# Altium project 8MPLUSLPD4-CPU.PrjPcb (part 1 of 3)
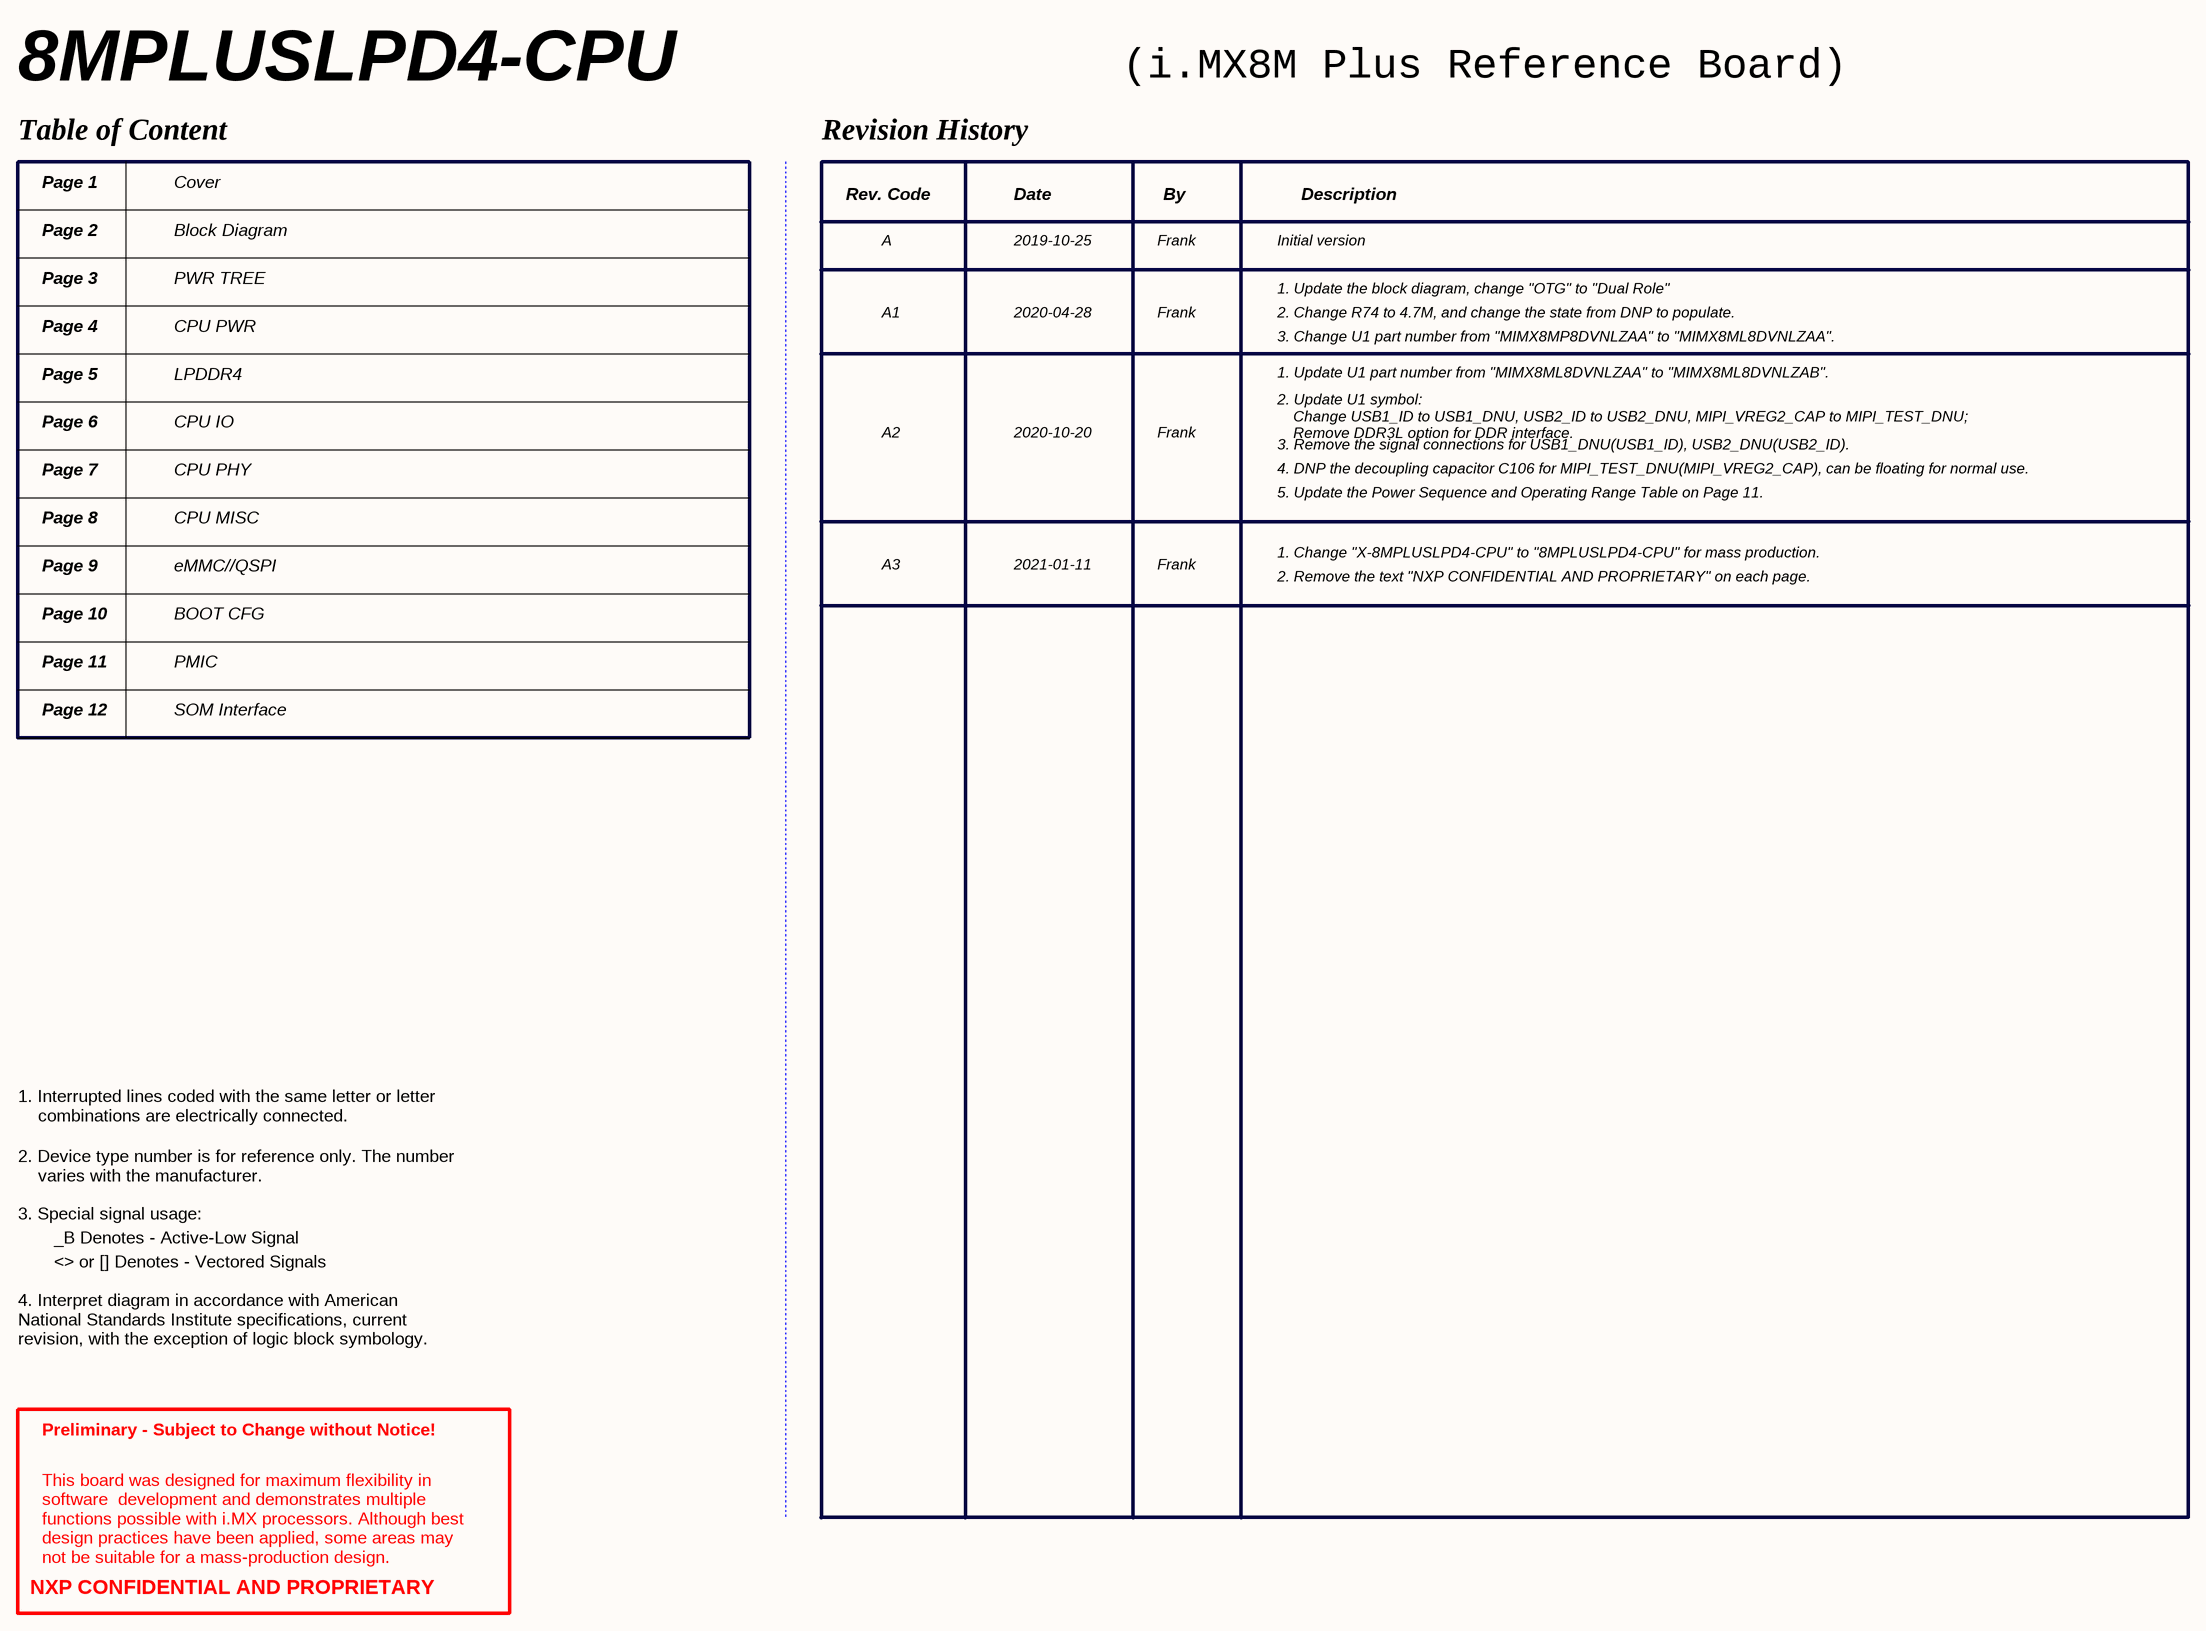
[diagram p0: Page01 COVER.SchDoc]
12 sheets, 271 parts. Net scope: global (net labels, ports and power ports of the same name join across sheets).
Board file: LAY-46368_A1_Altium.PcbDoc
Sheets:
  Page01 COVER.SchDoc
  Page02 BLOCK DIAGRAM.SchDoc
  Page03 PWR TREE.SchDoc
  Page04 CPU PWR.SchDoc
  Page05 LPDDR4.SchDoc
  Page06 CPU IO.SchDoc
  Page07 CPU PHY.SchDoc
  Page08 CPU MISC.SchDoc
  Page09 eMMC_QSPI.SchDoc
  Page10 BOOT_CFG.SchDoc
  Page11 PMIC.SchDoc
  Page12 SOM Interface.SchDoc

## Sheet Page01 COVER.SchDoc
size 513 x 386 mm

### Notes on the sheet
- 8MPLUSLPD4-CPU
- (i.MX8M Plus Reference Board)
- Table of Content
- Revision History
- Page 1
- Page 2
- Cover
- Block Diagram
- Rev. Code
- A
- Date
- 2019-10-25
- Frank
- By
- Initial version
- Description
- Page 3
- PWR TREE
- 1. Update the block diagram, change "OTG" to "Dual Role"
- Page 4
- CPU PWR
- A1
- 2020-04-28
- 2. Change R74 to 4.7M, and change the state from DNP to populate.
- 3. Change U1 part number from "MIMX8MP8DVNLZAA" to "MIMX8ML8DVNLZAA".
- Page 5
- LPDDR4
- 1. Update U1 part number from "MIMX8ML8DVNLZAA" to "MIMX8ML8DVNLZAB".
- 2. Update U1 symbol:
  Change USB1_ID to USB1_DNU, USB2_ID to USB2_DNU, MIPI_VREG2_CAP to MIPI_TEST_DNU;
  Remove DDR3L option for DDR interface.
- Page 6
- Page 7
- CPU IO
- CPU PHY
- A2
- 2020-10-20
- 3. Remove the signal connections for USB1_DNU(USB1_ID), USB2_DNU(USB2_ID).
- 4. DNP the decoupling capacitor C106 for MIPI_TEST_DNU(MIPI_VREG2_CAP), can be floating for normal use.
- Page 8
- CPU MISC
- 5. Update the Power Sequence and Operating Range Table on Page 11.
- Page 9
- eMMC//QSPI
- A3
- 2021-01-11
- 1. Change "X-8MPLUSLPD4-CPU" to "8MPLUSLPD4-CPU" for mass production.
- 2. Remove the text "NXP CONFIDENTIAL AND PROPRIETARY" on each page.
- Page 10
- BOOT CFG
- Page 11
- Page 12
- PMIC
- SOM Interface
- 1. Interrupted lines coded with the same letter or letter
  combinations are electrically connected.
- 2. Device type number is for reference only. The number
  varies with the manufacturer.
- 3. Special signal usage:
- _B Denotes - Active-Low Signal
- 4. Interpret diagram in accordance with American
  National Standards Institute specifications, current
  revision, with the exception of logic block symbology.
- <> or [] Denotes - Vectored Signals
- Preliminary - Subject to Change without Notice!
- This board was designed for maximum flexibility in
  software  development and demonstrates multiple
  functions possible with i.MX processors. Although best
  design practices have been applied, some areas may
  not be suitable for a mass-production design.
- NXP CONFIDENTIAL AND PROPRIETARY

## Sheet Page02 BLOCK DIAGRAM.SchDoc
size 513 x 386 mm
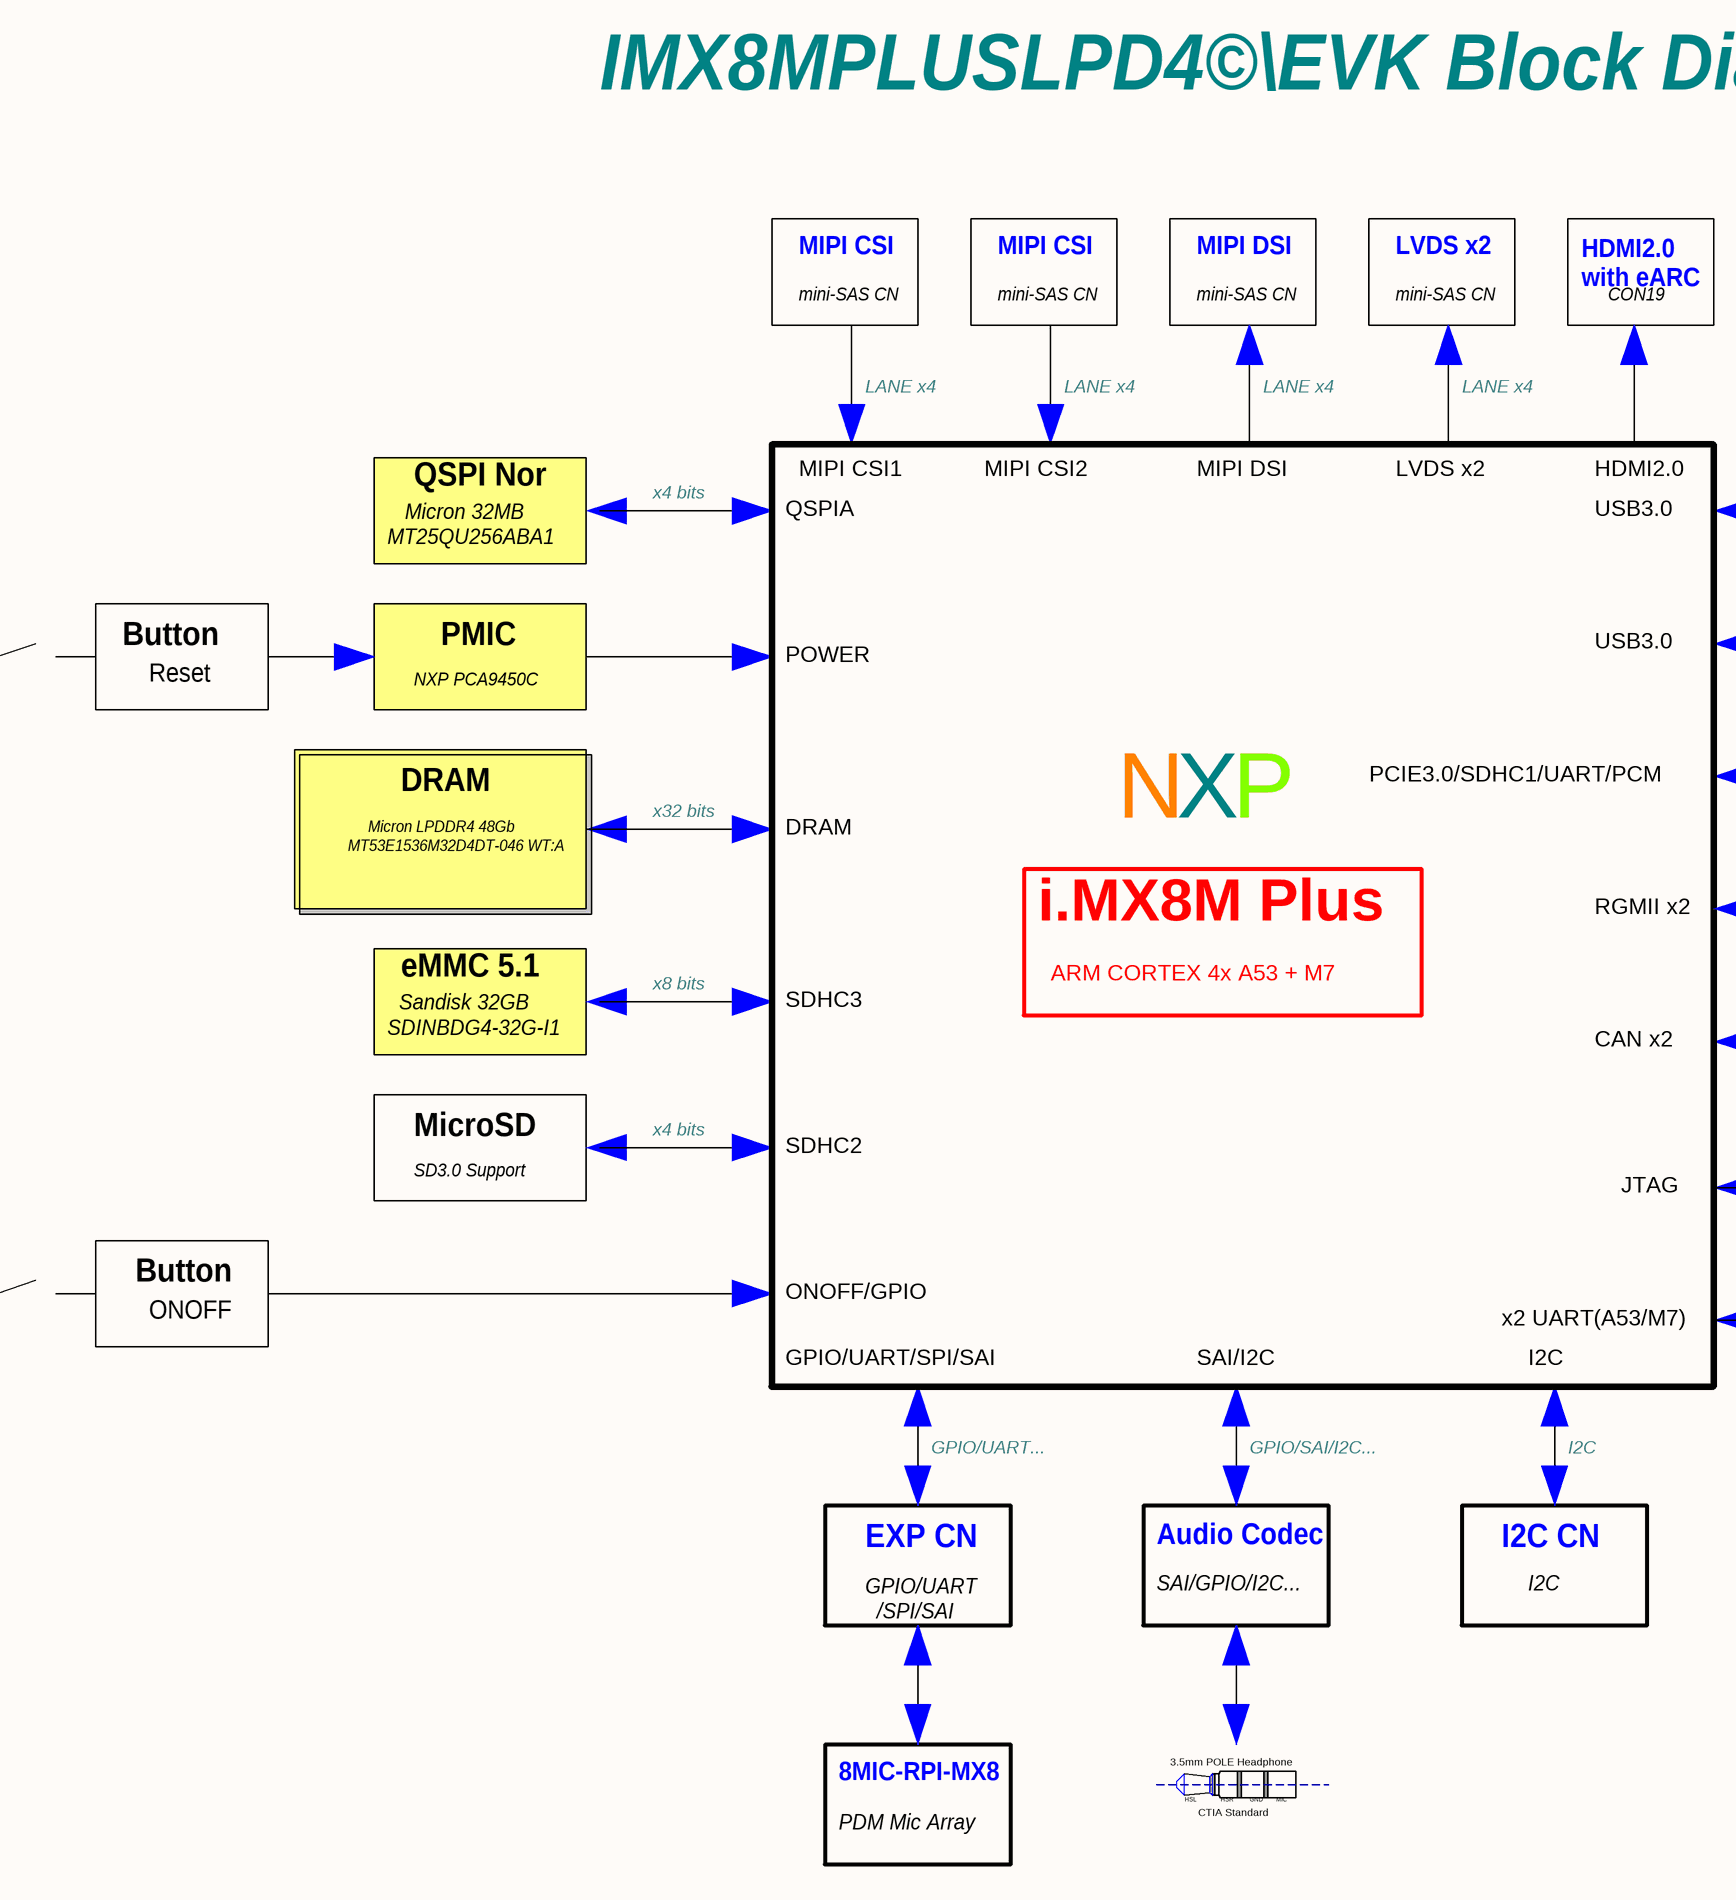
[diagram p1: Page02 BLOCK DIAGRAM.SchDoc, left]
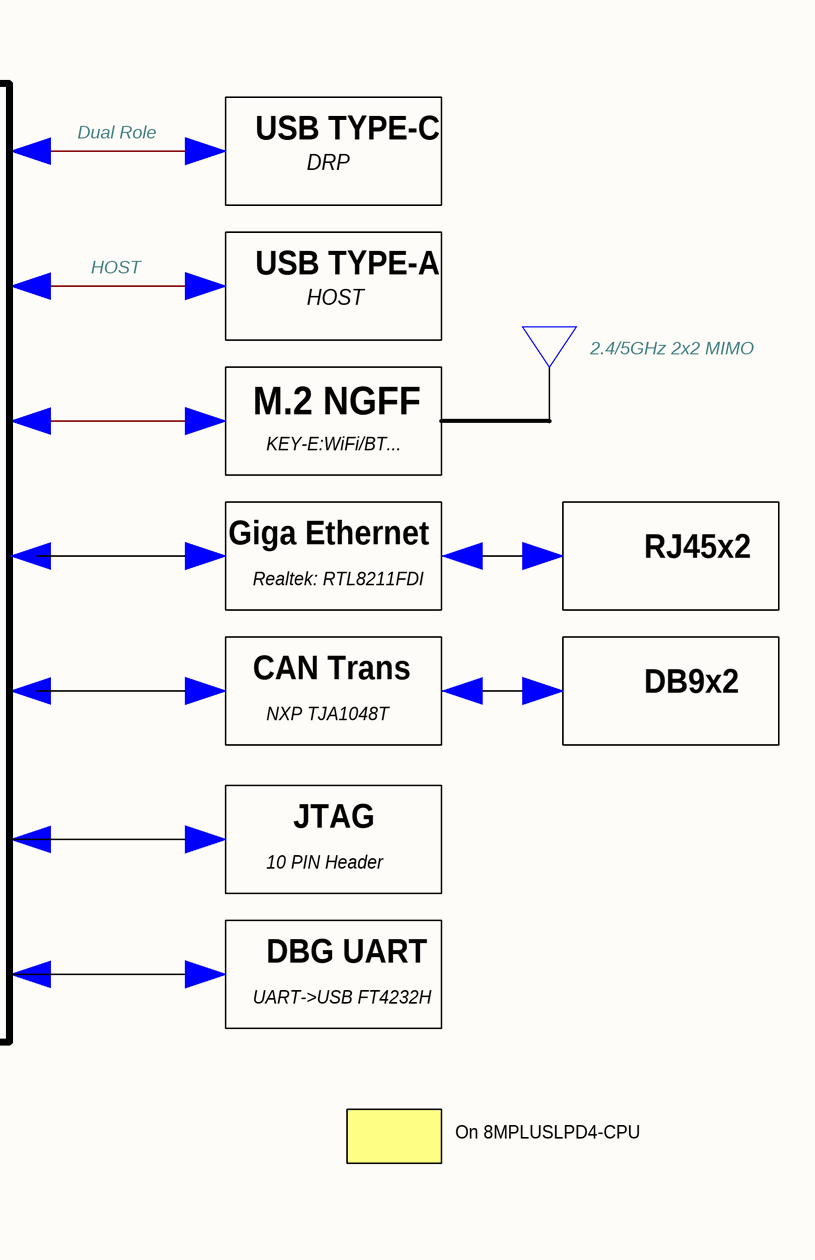
[diagram p2: Page02 BLOCK DIAGRAM.SchDoc, right]

### Notes on the sheet
- IMX8MPLUSLPD4©\EVK Block Diagram
- MIPI CSI
- MIPI DSI
- LVDS x2
- HDMI2.0
  with eARC
- mini-SAS CN
- CON19
- LANE x4
- Micron 32MB
  MT25QU256ABA1
- QSPI Nor
- x4 bits
- QSPIA
- MIPI CSI1
- MIPI CSI2
- HDMI2.0
- USB3.0
- Dual Role
- USB TYPE-C
- DRP
- Button
- Reset
- PMIC
- POWER
- HOST
- USB TYPE-A
- NXP PCA9450C
- 2.4/5GHz 2x2 MIMO
- DRAM
- PCIE3.0/SDHC1/UART/PCM
- M.2 NGFF
- Micron LPDDR4 48Gb
  MT53E1536M32D4DT-046 WT:A
- x32 bits
- N
- X
- P
- KEY-E:WiFi/BT...
- i.MX8M Plus
- RGMII x2
- Giga Ethernet
- RJ45x2
- Sandisk 32GB
  SDINBDG4-32G-I1
- eMMC 5.1
- x8 bits
- ARM CORTEX 4x A53 + M7
- Realtek: RTL8211FDI
- SDHC3
- CAN x2
- CAN Trans
- DB9x2
- NXP TJA1048T
- MicroSD
- SD3.0 Support
- SDHC2
- JTAG
- 10 PIN Header
- ONOFF
- ONOFF/GPIO
- x2 UART(A53/M7)
- DBG UART
- GPIO/UART/SPI/SAI
- SAI/I2C
- I2C
- UART->USB FT4232H
- GPIO/UART...
- GPIO/SAI/I2C...
- On 8MPLUSLPD4-CPU
- EXP CN
- GPIO/UART
  /SPI/SAI
- SAI/GPIO/I2C...
- Audio Codec
- I2C CN
- 8MIC-RPI-MX8
- 3.5mm POLE Headphone
- PDM Mic Array
- HSL
- CTIA Standard
- HSR
- GND
- MIC

## Sheet Page03 PWR TREE.SchDoc
size 513 x 386 mm
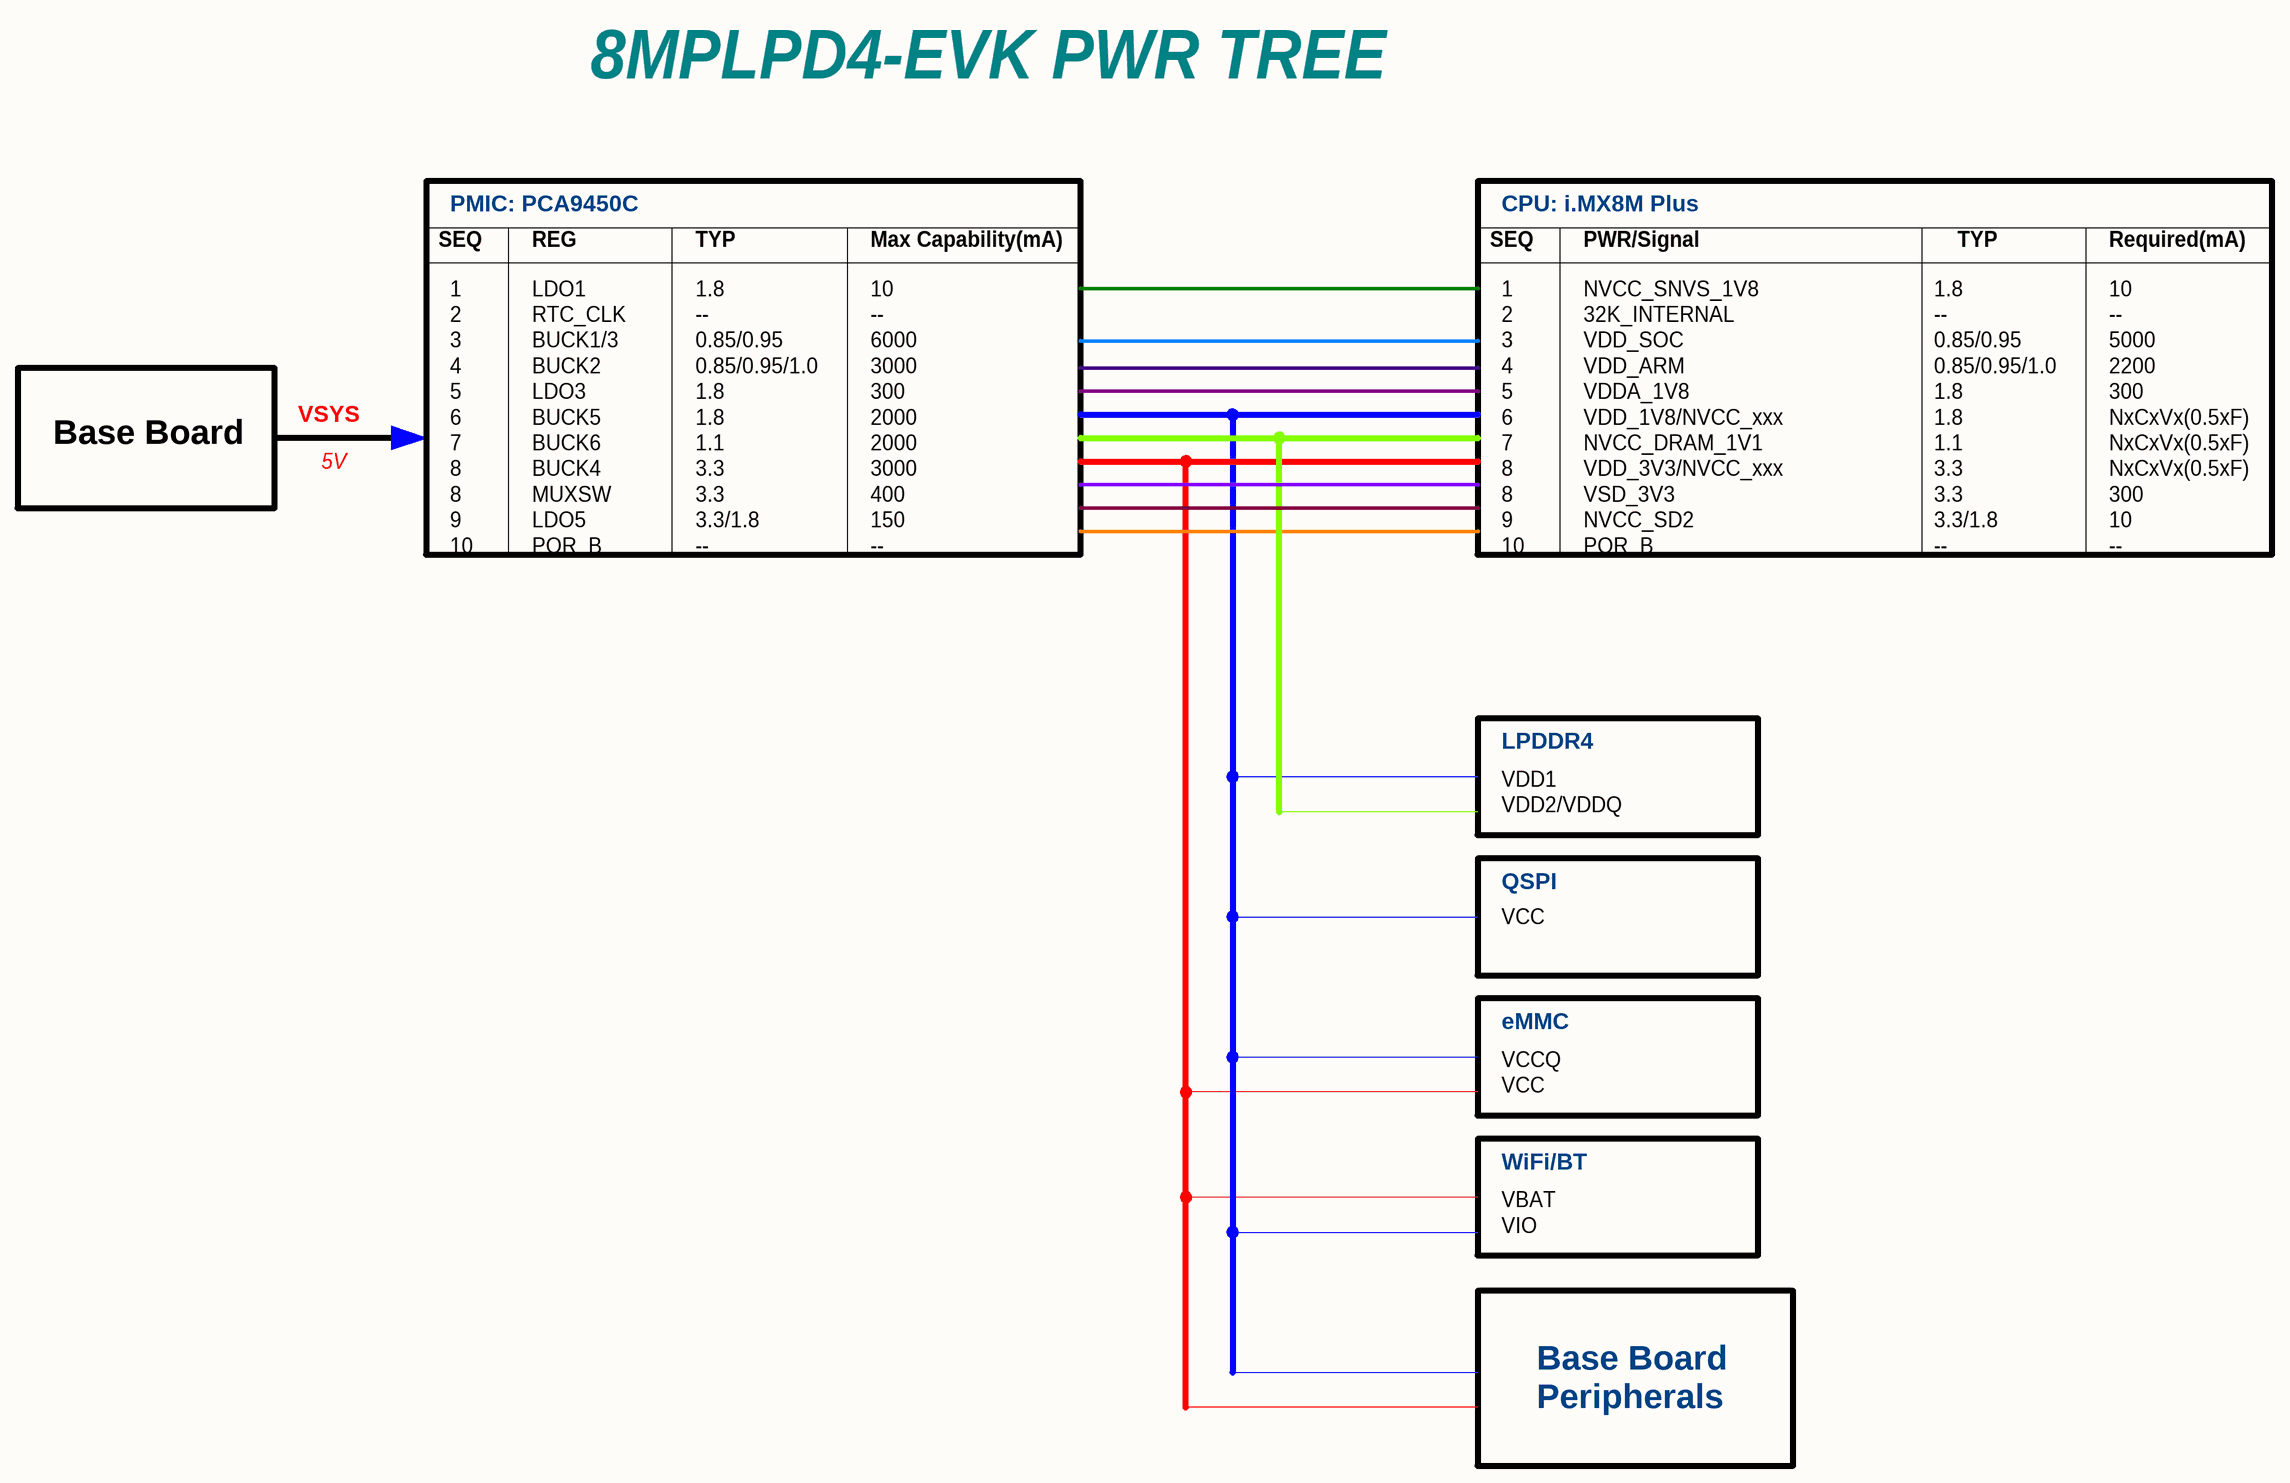
[diagram p3: Page03 PWR TREE.SchDoc]

### Notes on the sheet
- 8MPLPD4-EVK PWR TREE
- PMIC: PCA9450C
- CPU: i.MX8M Plus
- SEQ
- REG
- TYP
- Max Capability(mA)
- PWR/Signal
- Required(mA)
- Base Board
- VSYS
- 5V
- 1
  2
  3
  4
  5
  6
  7
  8
  8
  9
  10
- LDO1
  RTC_CLK
  BUCK1/3
  BUCK2
  LDO3
  BUCK5
  BUCK6
  BUCK4
  MUXSW
  LDO5
  POR_B
- 1.8
  --
  0.85/0.95
  0.85/0.95/1.0
  1.8
  1.8
  1.1
  3.3
  3.3
  3.3/1.8
  --
- 10
  --
  6000
  3000
  300
  2000
  2000
  3000
  400
  150
  --
- NVCC_SNVS_1V8
  32K_INTERNAL
  VDD_SOC
  VDD_ARM
  VDDA_1V8
  VDD_1V8/NVCC_xxx
  NVCC_DRAM_1V1
  VDD_3V3/NVCC_xxx
  VSD_3V3
  NVCC_SD2
  POR_B
- 10
  --
  5000
  2200
  300
  NxCxVx(0.5xF)
  NxCxVx(0.5xF)
  NxCxVx(0.5xF)
  300
  10
  --
- LPDDR4
- VDD1
  VDD2/VDDQ
- QSPI
- VCC
- eMMC
- VCCQ
  VCC
- WiFi/BT
- VBAT
  VIO
- Base Board
  Peripherals

## Sheet Page04 CPU PWR.SchDoc
size 513 x 386 mm
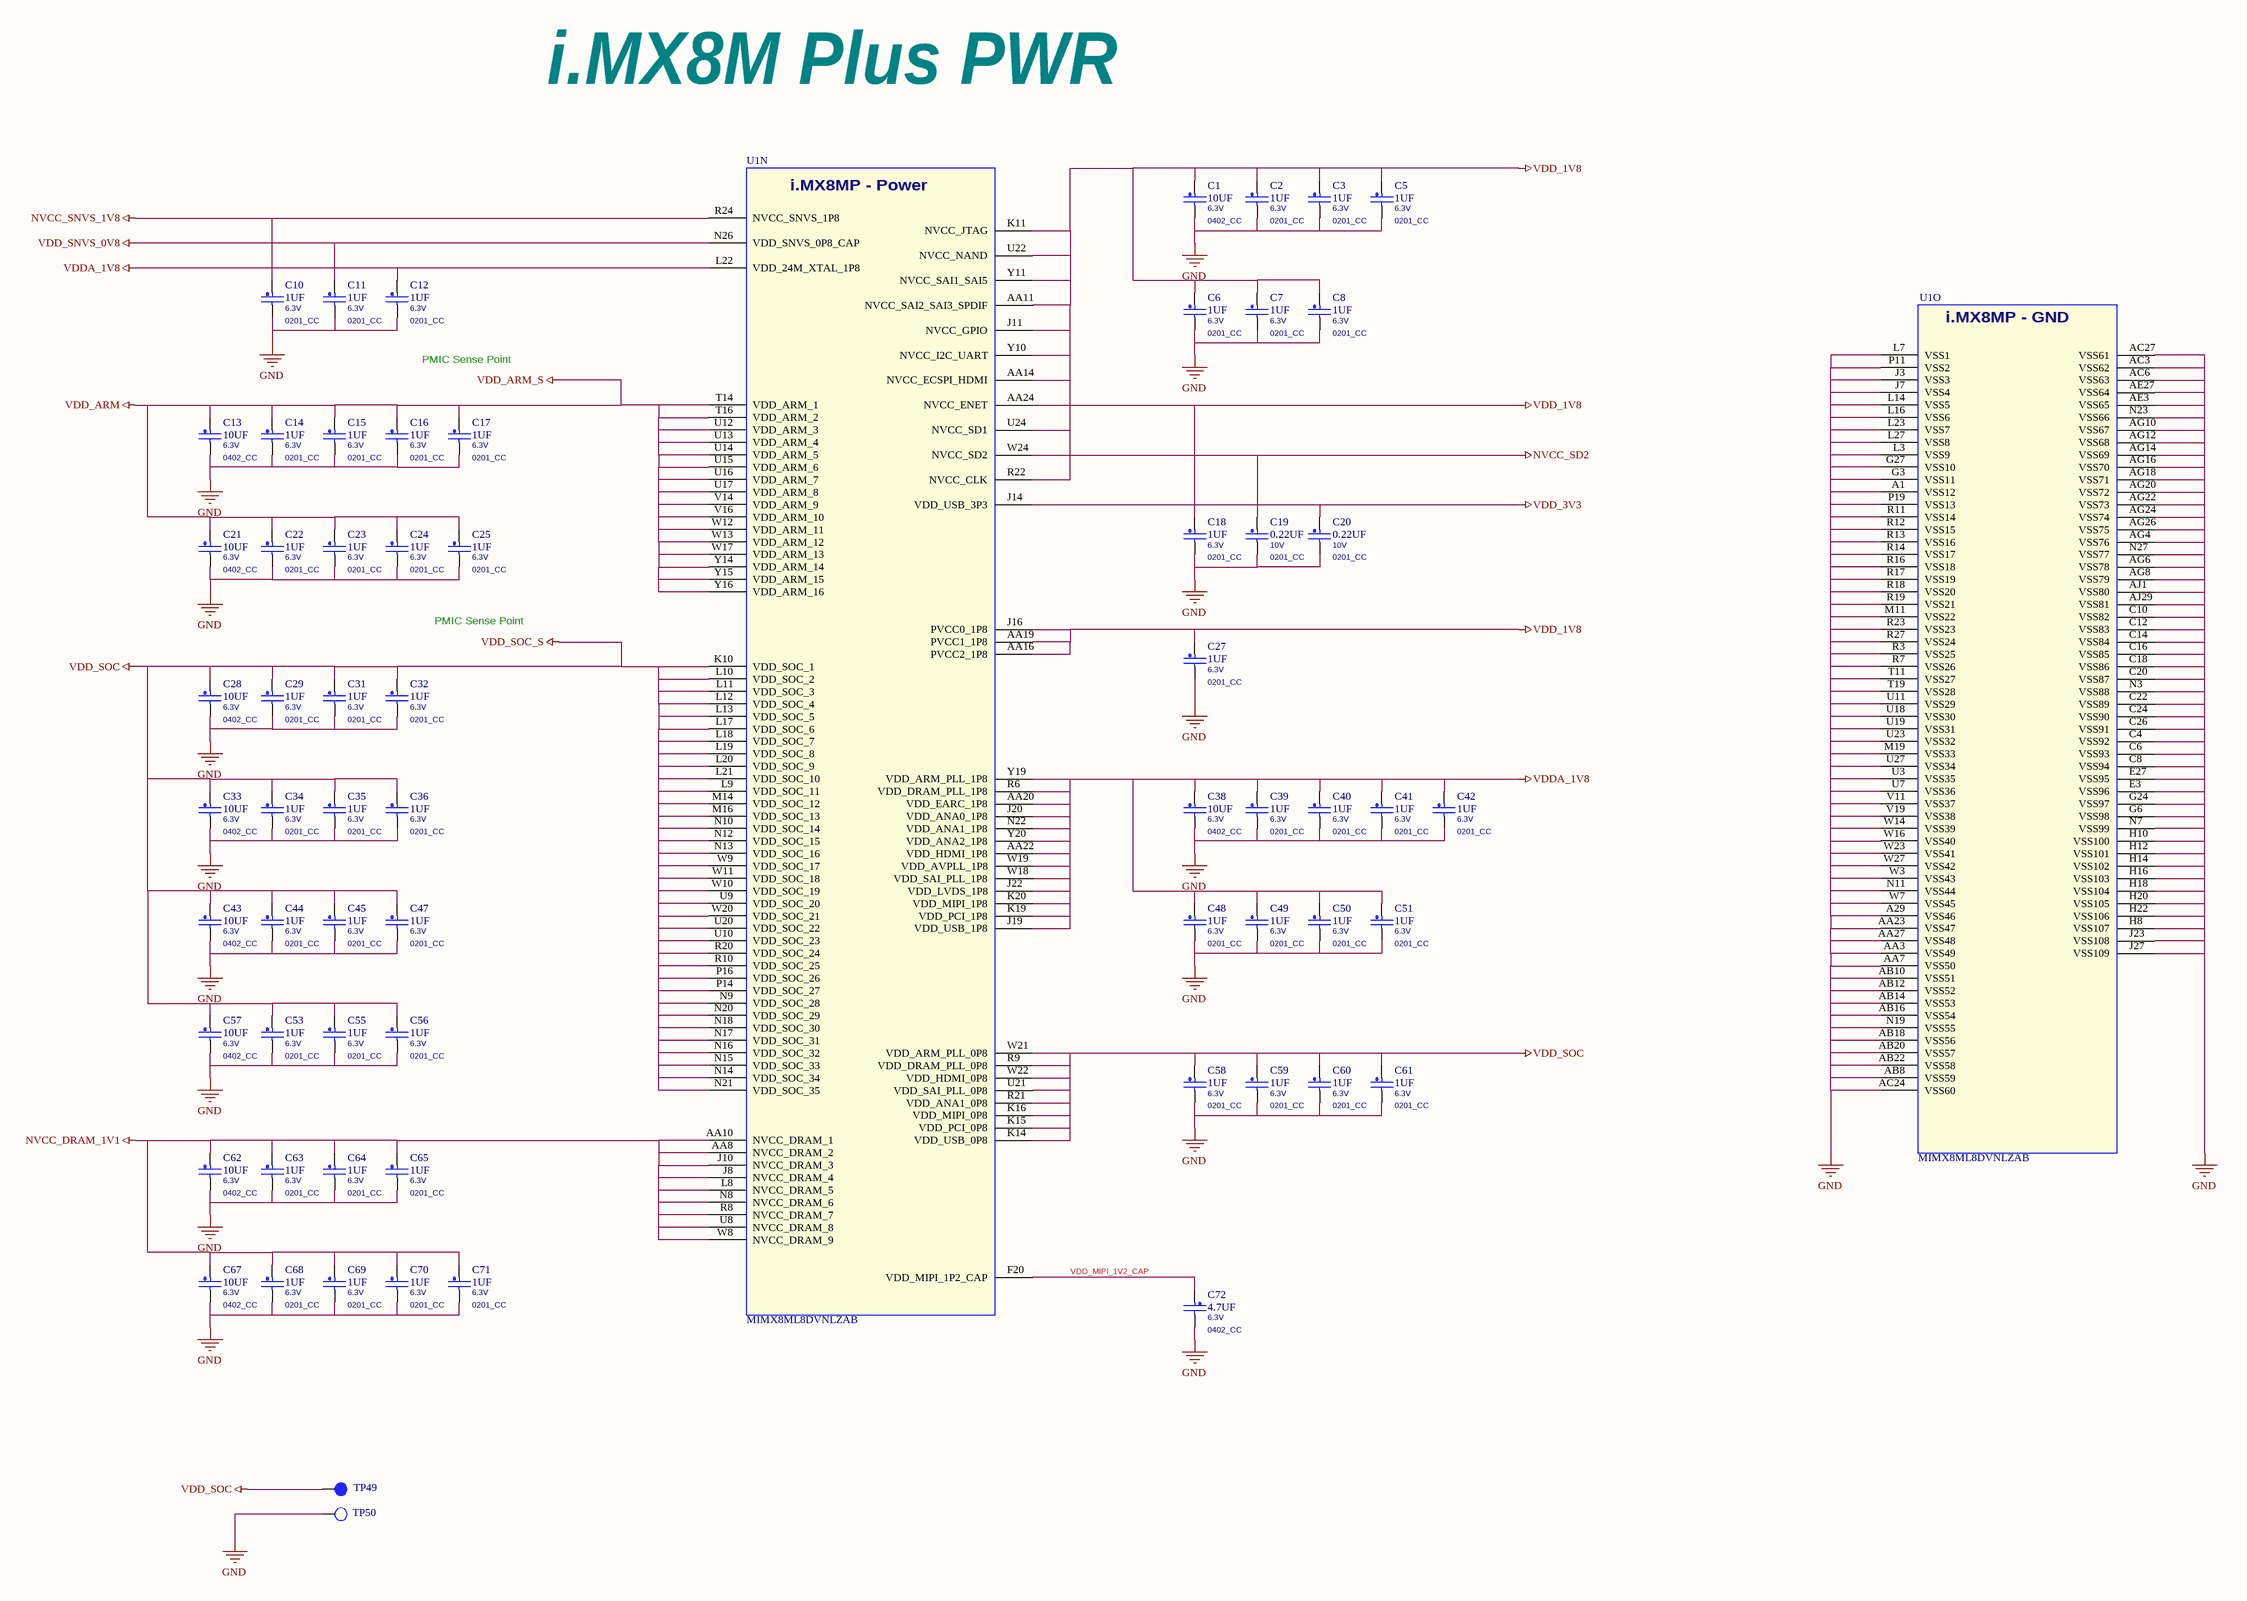
[diagram p4: Page04 CPU PWR.SchDoc]

### Parts
C1  10UF  VOLTAGE: 6.3V  [0402_CC]
C2  1UF  VOLTAGE: 6.3V  [0201_CC]
C3  1UF  VOLTAGE: 6.3V  [0201_CC]
C5  1UF  VOLTAGE: 6.3V  [0201_CC]
C6  1UF  VOLTAGE: 6.3V  [0201_CC]
C7  1UF  VOLTAGE: 6.3V  [0201_CC]
C8  1UF  VOLTAGE: 6.3V  [0201_CC]
C10  1UF  VOLTAGE: 6.3V  [0201_CC]
C11  1UF  VOLTAGE: 6.3V  [0201_CC]
C12  1UF  VOLTAGE: 6.3V  [0201_CC]
C13  10UF  VOLTAGE: 6.3V  [0402_CC]
C14  1UF  VOLTAGE: 6.3V  [0201_CC]
C15  1UF  VOLTAGE: 6.3V  [0201_CC]
C16  1UF  VOLTAGE: 6.3V  [0201_CC]
C17  1UF  VOLTAGE: 6.3V  [0201_CC]
C18  1UF  VOLTAGE: 6.3V  [0201_CC]
C19  0.22UF  VOLTAGE: 10V  [0201_CC]
C20  0.22UF  VOLTAGE: 10V  [0201_CC]
C21  10UF  VOLTAGE: 6.3V  [0402_CC]
C22  1UF  VOLTAGE: 6.3V  [0201_CC]
C23  1UF  VOLTAGE: 6.3V  [0201_CC]
C24  1UF  VOLTAGE: 6.3V  [0201_CC]
C25  1UF  VOLTAGE: 6.3V  [0201_CC]
C27  1UF  VOLTAGE: 6.3V  [0201_CC]
C28  10UF  VOLTAGE: 6.3V  [0402_CC]
C29  1UF  VOLTAGE: 6.3V  [0201_CC]
C31  1UF  VOLTAGE: 6.3V  [0201_CC]
C32  1UF  VOLTAGE: 6.3V  [0201_CC]
C33  10UF  VOLTAGE: 6.3V  [0402_CC]
C34  1UF  VOLTAGE: 6.3V  [0201_CC]
C35  1UF  VOLTAGE: 6.3V  [0201_CC]
C36  1UF  VOLTAGE: 6.3V  [0201_CC]
C38  10UF  VOLTAGE: 6.3V  [0402_CC]
C39  1UF  VOLTAGE: 6.3V  [0201_CC]
C40  1UF  VOLTAGE: 6.3V  [0201_CC]
C41  1UF  VOLTAGE: 6.3V  [0201_CC]
C42  1UF  VOLTAGE: 6.3V  [0201_CC]
C43  10UF  VOLTAGE: 6.3V  [0402_CC]
C44  1UF  VOLTAGE: 6.3V  [0201_CC]
C45  1UF  VOLTAGE: 6.3V  [0201_CC]
C47  1UF  VOLTAGE: 6.3V  [0201_CC]
C48  1UF  VOLTAGE: 6.3V  [0201_CC]
C49  1UF  VOLTAGE: 6.3V  [0201_CC]
C50  1UF  VOLTAGE: 6.3V  [0201_CC]
C51  1UF  VOLTAGE: 6.3V  [0201_CC]
C53  1UF  VOLTAGE: 6.3V  [0201_CC]
C55  1UF  VOLTAGE: 6.3V  [0201_CC]
C56  1UF  VOLTAGE: 6.3V  [0201_CC]
C57  10UF  VOLTAGE: 6.3V  [0402_CC]
C58  1UF  VOLTAGE: 6.3V  [0201_CC]
C59  1UF  VOLTAGE: 6.3V  [0201_CC]
C60  1UF  VOLTAGE: 6.3V  [0201_CC]
C61  1UF  VOLTAGE: 6.3V  [0201_CC]
C62  10UF  VOLTAGE: 6.3V  [0402_CC]
C63  1UF  VOLTAGE: 6.3V  [0201_CC]
C64  1UF  VOLTAGE: 6.3V  [0201_CC]
C65  1UF  VOLTAGE: 6.3V  [0201_CC]
C67  10UF  VOLTAGE: 6.3V  [0402_CC]
C68  1UF  VOLTAGE: 6.3V  [0201_CC]
C69  1UF  VOLTAGE: 6.3V  [0201_CC]
C70  1UF  VOLTAGE: 6.3V  [0201_CC]
C71  1UF  VOLTAGE: 6.3V  [0201_CC]
C72  4.7UF  voltage rating: 6.3V  [0402_CC]
TP49  tpad_020  [tpad_020]  (value not drawn)
TP50  TP_35MIL  [testpoint_35mil]  (value not drawn)
U1  MIMX8ML8DVNLZAB  [BGA_M865S_0P5_15X15-BMS]  (parts N,O of 15)

### Nets
GND: C1.2 C2.2 C3.2 C5.2 C6.2 C7.2 C8.2 C10.2 C11.2 C12.2 C13.2 C14.2 C15.2 C16.2 C17.2 C18.2 C19.2 C20.2 C21.2 C22.2 C23.2 C24.2 C25.2 C27.2 C28.2 C29.2 C31.2 C32.2 C33.2 C34.2 C35.2 C36.2 C38.2 C39.2 C40.2 C41.2 C42.2 C43.2 C44.2 C45.2 C47.2 C48.2 C49.2 C50.2 C51.2 C53.2 C55.2 C56.2 C57.2 C58.2 C59.2 C60.2 C61.2 C62.2 C63.2 C64.2 C65.2 C67.2 C68.2 C69.2 C70.2 C71.2 C72.2 TP50.1(TP) U1.A1(VSS12) U1.A29(VSS46) U1.AA3(VSS49) U1.AA7(VSS50) U1.AA23(VSS47) U1.AA27(VSS48) U1.AB8(VSS59) U1.AB10(VSS51) U1.AB12(VSS52) U1.AB14(VSS53) U1.AB16(VSS54) U1.AB18(VSS56) U1.AB20(VSS57) U1.AB22(VSS58) U1.AC3(VSS62) U1.AC6(VSS63) U1.AC24(VSS60) U1.AC27(VSS61) U1.AE3(VSS65) U1.AE27(VSS64) U1.AG4(VSS76) U1.AG6(VSS78) U1.AG8(VSS79) U1.AG10(VSS67) U1.AG12(VSS68) U1.AG14(VSS69) U1.AG16(VSS70) U1.AG18(VSS71) U1.AG20(VSS72) U1.AG22(VSS73) U1.AG24(VSS74) U1.AG26(VSS75) U1.AJ1(VSS80) U1.AJ29(VSS81) U1.C4(VSS92) U1.C6(VSS93) U1.C8(VSS94) U1.C10(VSS82) U1.C12(VSS83) U1.C14(VSS84) U1.C16(VSS85) U1.C18(VSS86) U1.C20(VSS87) U1.C22(VSS89) U1.C24(VSS90) U1.C26(VSS91) U1.E3(VSS96) U1.E27(VSS95) U1.G3(VSS11) U1.G6(VSS98) U1.G24(VSS97) U1.G27(VSS10) U1.H8(VSS107) U1.H10(VSS100) U1.H12(VSS101) U1.H14(VSS102) U1.H16(VSS103) U1.H18(VSS104) U1.H20(VSS105) U1.H22(VSS106) U1.J3(VSS3) U1.J7(VSS4) U1.J23(VSS108) U1.J27(VSS109) U1.L3(VSS9) U1.L7(VSS1) U1.L14(VSS5) U1.L16(VSS6) U1.L23(VSS7) U1.L27(VSS8) U1.M11(VSS22) U1.M19(VSS33) U1.N3(VSS88) U1.N7(VSS99) U1.N11(VSS44) U1.N19(VSS55) U1.N23(VSS66) U1.N27(VSS77) U1.P11(VSS2) U1.P19(VSS13) U1.R3(VSS25) U1.R7(VSS26) U1.R11(VSS14) U1.R12(VSS15) U1.R13(VSS16) U1.R14(VSS17) U1.R16(VSS18) U1.R17(VSS19) U1.R18(VSS20) U1.R19(VSS21) U1.R23(VSS23) U1.R27(VSS24) U1.T11(VSS27) U1.T19(VSS28) U1.U3(VSS35) U1.U7(VSS36) U1.U11(VSS29) U1.U18(VSS30) U1.U19(VSS31) U1.U23(VSS32) U1.U27(VSS34) U1.V11(VSS37) U1.V19(VSS38) U1.W3(VSS43) U1.W7(VSS45) U1.W14(VSS39) U1.W16(VSS40) U1.W23(VSS41) U1.W27(VSS42)
NVCC_DRAM_1V1: C62.1 C63.1 C64.1 C65.1 C67.1 C68.1 C69.1 C70.1 C71.1 U1.AA8(NVCC_DRAM_2) U1.AA10(NVCC_DRAM_1) U1.J8(NVCC_DRAM_4) U1.J10(NVCC_DRAM_3) U1.L8(NVCC_DRAM_5) U1.N8(NVCC_DRAM_6) U1.R8(NVCC_DRAM_7) U1.U8(NVCC_DRAM_8) U1.W8(NVCC_DRAM_9)  [project net ODT_CA_A]
NVCC_SD2: C19.1 U1.W24(NVCC_SD2)
NVCC_SNVS_1V8: C10.1 U1.R24(NVCC_SNVS_1P8)
VDD_1V8: C1.1 C2.1 C3.1 C5.1 C6.1 C7.1 C8.1 C18.1 C27.1 U1.AA11(NVCC_SAI2_SAI3_SPDIF) U1.AA14(NVCC_ECSPI_HDMI) U1.AA16(PVCC2_1P8) U1.AA19(PVCC1_1P8) U1.AA24(NVCC_ENET) U1.J11(NVCC_GPIO) U1.J16(PVCC0_1P8) U1.K11(NVCC_JTAG) U1.R22(NVCC_CLK) U1.U22(NVCC_NAND) U1.U24(NVCC_SD1) U1.Y10(NVCC_I2C_UART) U1.Y11(NVCC_SAI1_SAI5)
VDD_3V3: C20.1 U1.J14(VDD_USB_3P3)
VDD_ARM: C13.1 C14.1 C15.1 C16.1 C17.1 C21.1 C22.1 C23.1 C24.1 C25.1 U1.T14(VDD_ARM_1) U1.T16(VDD_ARM_2) U1.U12(VDD_ARM_3) U1.U13(VDD_ARM_4) U1.U14(VDD_ARM_5) U1.U15(VDD_ARM_6) U1.U16(VDD_ARM_7) U1.U17(VDD_ARM_8) U1.V14(VDD_ARM_9) U1.V16(VDD_ARM_10) U1.W12(VDD_ARM_11) U1.W13(VDD_ARM_12) U1.W17(VDD_ARM_13) U1.Y14(VDD_ARM_14) U1.Y15(VDD_ARM_15) U1.Y16(VDD_ARM_16)  [also labelled VDD_ARM_S]
VDD_SNVS_0V8: C11.1 U1.N26(VDD_SNVS_0P8_CAP)
VDD_SOC: C28.1 C29.1 C31.1 C32.1 C33.1 C34.1 C35.1 C36.1 C43.1 C44.1 C45.1 C47.1 C53.1 C55.1 C56.1 C57.1 C58.1 C59.1 C60.1 C61.1 TP49.1(Pin1) U1.K10(VDD_SOC_1) U1.K14(VDD_USB_0P8) U1.K15(VDD_PCI_0P8) U1.K16(VDD_MIPI_0P8) U1.L9(VDD_SOC_11) U1.L10(VDD_SOC_2) U1.L11(VDD_SOC_3) U1.L12(VDD_SOC_4) U1.L13(VDD_SOC_5) U1.L17(VDD_SOC_6) U1.L18(VDD_SOC_7) U1.L19(VDD_SOC_8) U1.L20(VDD_SOC_9) U1.L21(VDD_SOC_10) U1.M14(VDD_SOC_12) U1.M16(VDD_SOC_13) U1.N9(VDD_SOC_28) U1.N10(VDD_SOC_14) U1.N12(VDD_SOC_15) U1.N13(VDD_SOC_16) U1.N14(VDD_SOC_34) U1.N15(VDD_SOC_33) U1.N16(VDD_SOC_32) U1.N17(VDD_SOC_31) U1.N18(VDD_SOC_30) U1.N20(VDD_SOC_29) U1.N21(VDD_SOC_35) U1.P14(VDD_SOC_27) U1.P16(VDD_SOC_26) U1.R9(VDD_DRAM_PLL_0P8) U1.R10(VDD_SOC_25) U1.R20(VDD_SOC_24) U1.R21(VDD_ANA1_0P8) U1.U9(VDD_SOC_20) U1.U10(VDD_SOC_23) U1.U20(VDD_SOC_22) U1.U21(VDD_SAI_PLL_0P8) U1.W9(VDD_SOC_17) U1.W10(VDD_SOC_19) U1.W11(VDD_SOC_18) U1.W20(VDD_SOC_21) U1.W21(VDD_ARM_PLL_0P8) U1.W22(VDD_HDMI_0P8)  [also labelled VDD_SOC_S]
VDDA_1V8: C12.1 C38.1 C39.1 C40.1 C41.1 C42.1 C48.1 C49.1 C50.1 C51.1 U1.AA20(VDD_EARC_1P8) U1.AA22(VDD_HDMI_1P8) U1.J19(VDD_USB_1P8) U1.J20(VDD_ANA0_1P8) U1.J22(VDD_LVDS_1P8) U1.K19(VDD_PCI_1P8) U1.K20(VDD_MIPI_1P8) U1.L22(VDD_24M_XTAL_1P8) U1.N22(VDD_ANA1_1P8) U1.R6(VDD_DRAM_PLL_1P8) U1.W18(VDD_SAI_PLL_1P8) U1.W19(VDD_AVPLL_1P8) U1.Y19(VDD_ARM_PLL_1P8) U1.Y20(VDD_ANA2_1P8)
VDD_MIPI_1V2_CAP: C72.1 U1.F20(VDD_MIPI_1P2_CAP)

### Notes on the sheet
- i.MX8M Plus PWR
- PMIC Sense Point
- (in symbol MIMX8MP_BGA548, part N) i.MX8MP - Power
- (in symbol MIMX8MP_BGA548, part O) i.MX8MP - GND

### Library data of the parts
C1 C38 C43 C57 C62 = CAP_NP: CAP CER 10UF 6.3V 20% X5R 0402; CLASS: DISCRETE; FPLIST: CC0402_25,CC0402_HD,0402_CC; CAD_APPROVED: Yes; MFG_PN01: CL05A106MQ5NUNC; MFG_NAME01: SAMSUNG ELECTRO MECHANICS; AGILE_PN: 150-79163; HEIGHT: 0.65 MM; ROHS: Yes; Tolerance: 20%; PCB Footprint: 0402_CC
C2 C5 C11 C12 C14-C18 C22-C25 C31 C34 C36 C39 C41 C42 C45 C49 C53 C56 C58 C60 C61 C68-C70 = CAP_NP: CAP CER 1uF 6.3V 20% X5R 0201; CLASS: DISCRETE; AGILE_PN: 150-79407; MFG_NAME01: AVX; MFG_PN01: 02016D105MAT2A; CAD_APPROVED: Yes; FPLIST: CC0201,CC0201_HD,0201_CC,0201_CC_012SM_NSP; Tolerance: 20%; ROHS: Yes; HEIGHT: 0.35MM; PCB Footprint: 0201_CC; Package Size: 0201; Package Type: 7¡± reel
C3 C6-C8 C10 C27 C29 C32 C35 C40 C44 C47 C48 C50 C51 C55 C59 C63-C65 C71 = CAP_NP: CAP CER 1uF 6.3V 20% X5R 0201; CLASS: DISCRETE; FPLIST: CC0201,CC0201_HD,0201_CC,0201_CC_012SM_NSP; CAD_APPROVED: Yes; MFG_PN01: 02016D105MAT2A; MFG_NAME01: AVX; AGILE_PN: 150-79407; HEIGHT: 0.35MM; ROHS: Yes; Tolerance: 20%; PCB Footprint: 0201_CC; Package Size: 0201; Package Type: 7¡± reel
C13 C21 C28 C33 C67 = CAP_NP: CAP CER 10UF 6.3V 20% X5R 0402; CLASS: DISCRETE; AGILE_PN: 150-79163; MFG_NAME01: SAMSUNG ELECTRO MECHANICS; MFG_PN01: CL05A106MQ5NUNC; CAD_APPROVED: Yes; FPLIST: CC0402_25,CC0402_HD,0402_CC; Tolerance: 20%; ROHS: Yes; HEIGHT: 0.65 MM; PCB Footprint: 0402_CC
C19 = CAP_NP: CAP CER 0.22UF 10V 20% X5R 0201; CLASS: DISCRETE; AGILE_PN: 150-78815; MFG_NAME01: Taiyo Yuden; MFG_PN01: LMK063BJ224MP-F; CAD_APPROVED: Yes; FPLIST: CC0201,CC0201_HD,0201_CC; Tolerance: 20%; ROHS: Yes; HEIGHT: 0.33MM; PCB Footprint: 0201_CC
C20 = CAP_NP: CAP CER 0.22UF 10V 20% X5R 0201; CLASS: DISCRETE; FPLIST: CC0201,CC0201_HD,0201_CC; CAD_APPROVED: Yes; MFG_PN01: LMK063BJ224MP-F; MFG_NAME01: Taiyo Yuden; AGILE_PN: 150-78815; HEIGHT: 0.33MM; ROHS: Yes; Tolerance: 20%; PCB Footprint: 0201_CC
C72 = CAP_NP: CAP CER 4.7UF 6.3V 20% X5R 0402; CLASS: DISCRETE; AGILE_PN: 150-78463; MFG_NAME01: TDK; MFG_PN01: C1005X5R0J475M050BC; CAD_APPROVED: Yes; FPLIST: CC0402_25,CC0402_HD,0402_CC; VOLTAGE: 6.3V; Tolerance: 20%; ROHS: Yes; HEIGHT: 0.65MM; PCB Footprint: 0402_CC
TP49 = TESTLOOP: TEST POINT PAD 0.5MM DIA SMT, NO PART TO ORDER; ASSY_OPT: DNP; CLASS: IO; AGILE_PN: 211-77484; CAD_APPROVED: Yes; ROHS: Yes; HEIGHT: 0.1MM; PCB Footprint: tpad_020
TP50 = T POINT R: TEST POINT PAD .035 SMT, no part to order; CLASS: IC; ASSY_OPT: DNP; AGILE_PN: 510-75618; CAD_APPROVED: Yes; ROHS: Yes; HEIGHT: 0.1MM; PCB Footprint: testpoint_35mil
U1 = MIMX8MP_BGA548: IC CPU QUAD CORTEX A53+M4 1.8GHZ BGA548; SPLIT_INST: TRUE; PCB Footprint: bga548_0p5_15x15mm; CAD_APPROVED: Yes; MFG_NAME01: NXP SEMICONDUCTORS; AGILE_PN: 330-77126; CLASS: IC; HEIGHT: 2.1MM; MFG_PN01: MIMX8ML8DVNLZAB

## Sheet Page05 LPDDR4.SchDoc
size 513 x 386 mm
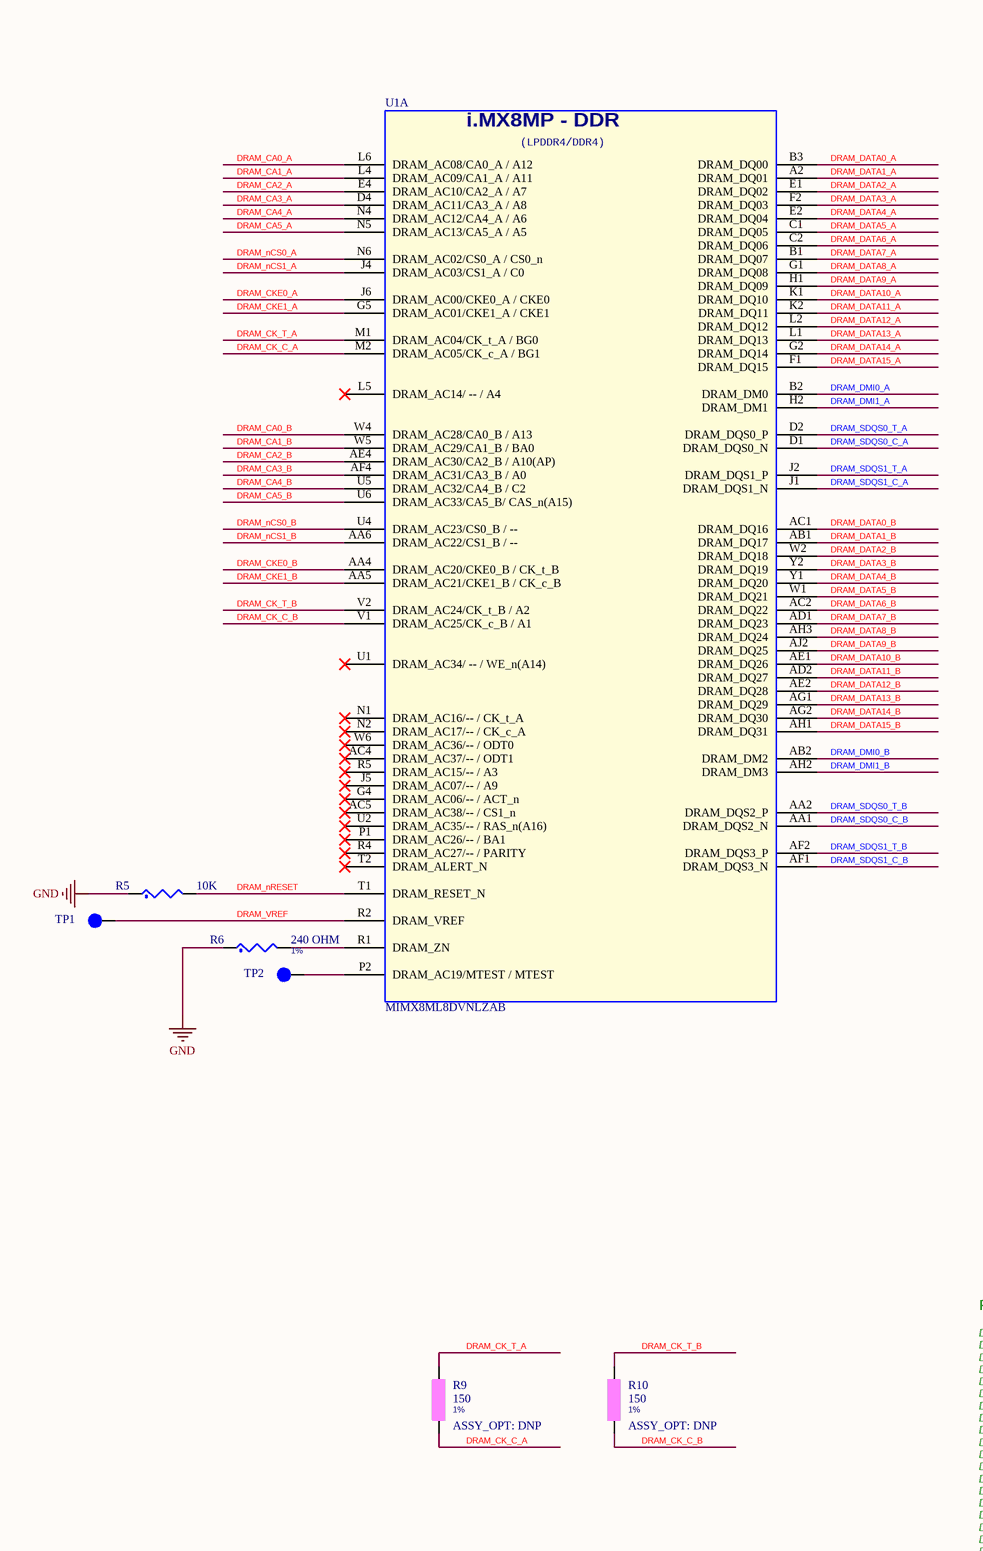
[diagram p5: Page05 LPDDR4.SchDoc, left]
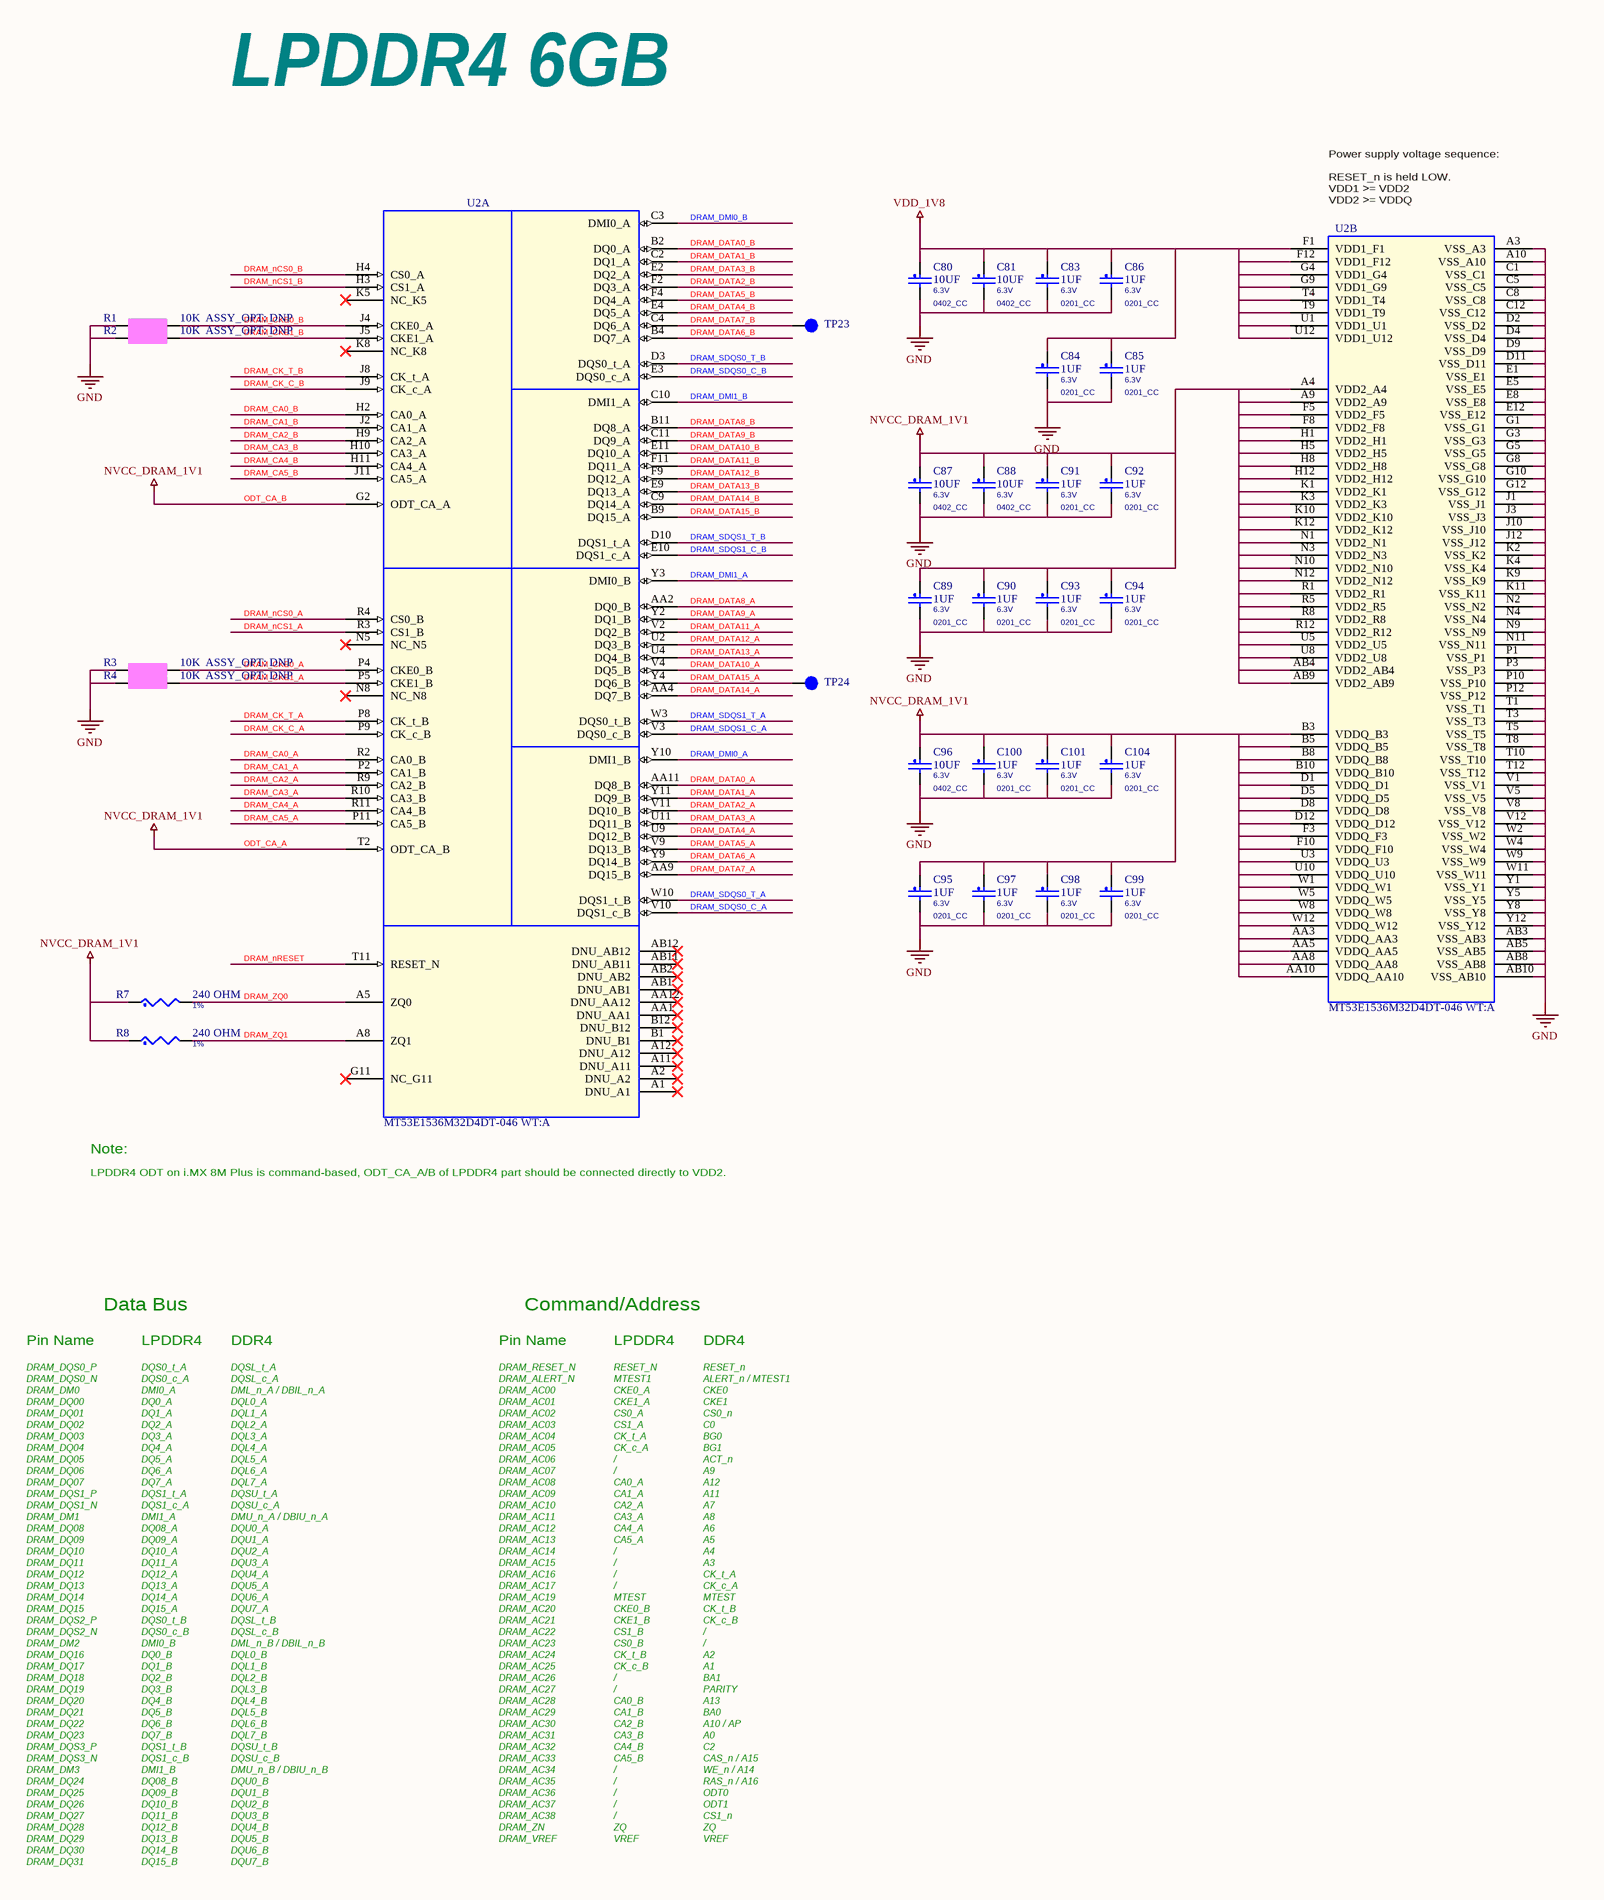
[diagram p6: Page05 LPDDR4.SchDoc, right]

### Parts
C80  10UF  VOLTAGE: 6.3V  [0402_CC]
C81  10UF  VOLTAGE: 6.3V  [0402_CC]
C83  1UF  VOLTAGE: 6.3V  [0201_CC]
C84  1UF  VOLTAGE: 6.3V  [0201_CC]
C85  1UF  VOLTAGE: 6.3V  [0201_CC]
C86  1UF  VOLTAGE: 6.3V  [0201_CC]
C87  10UF  VOLTAGE: 6.3V  [0402_CC]
C88  10UF  VOLTAGE: 6.3V  [0402_CC]
C89  1UF  VOLTAGE: 6.3V  [0201_CC]
C90  1UF  VOLTAGE: 6.3V  [0201_CC]
C91  1UF  VOLTAGE: 6.3V  [0201_CC]
C92  1UF  VOLTAGE: 6.3V  [0201_CC]
C93  1UF  VOLTAGE: 6.3V  [0201_CC]
C94  1UF  VOLTAGE: 6.3V  [0201_CC]
C95  1UF  VOLTAGE: 6.3V  [0201_CC]
C96  10UF  VOLTAGE: 6.3V  [0402_CC]
C97  1UF  VOLTAGE: 6.3V  [0201_CC]
C98  1UF  VOLTAGE: 6.3V  [0201_CC]
C99  1UF  VOLTAGE: 6.3V  [0201_CC]
C100  1UF  VOLTAGE: 6.3V  [0201_CC]
C101  1UF  VOLTAGE: 6.3V  [0201_CC]
C104  1UF  VOLTAGE: 6.3V  [0201_CC]
R1  10K  ASSY_OPT: DNP  [0402_CC]
R2  10K  ASSY_OPT: DNP  [0402_CC]
R3  10K  ASSY_OPT: DNP  [0402_CC]
R4  10K  ASSY_OPT: DNP  [0402_CC]
R5  10K  [0201_CC]
R6  240 OHM  Tolerance: 1%  [0201_CC]
R7  240 OHM  Tolerance: 1%  [0201_CC]
R8  240 OHM  Tolerance: 1%  [0201_CC]
R9  150  ASSY_OPT: DNP  Tolerance: 1%  [0402_CC]
R10  150  ASSY_OPT: DNP  Tolerance: 1%  [0402_CC]
TP1  TPAD_015  [TPAD_015]  (value not drawn)
TP2  TPAD_015  [TPAD_015]  (value not drawn)
TP23  tpad_020  [tpad_020]  (value not drawn)
TP24  tpad_020  [tpad_020]  (value not drawn)
U1  MIMX8ML8DVNLZAB  [BGA_M865S_0P5_15X15-BMS]  (part A of 15)
U2  MT53E1536M32D4DT-046 WT:A  [bga200_0p65x0p8_10p1x14p6]  (parts A,B of 2)

### Nets
GND: C80.2 C81.2 C83.2 C84.2 C85.2 C86.2 C87.2 C88.2 C89.2 C90.2 C91.2 C92.2 C93.2 C94.2 C95.2 C96.2 C97.2 C98.2 C99.2 C100.2 C101.2 C104.2 R1.1 R2.1 R3.1 R4.1 R5.1 R6.1 U2.A3(VSS_A3) U2.A10(VSS_A10) U2.AB3(VSS_AB3) U2.AB5(VSS_AB5) U2.AB8(VSS_AB8) U2.AB10(VSS_AB10) U2.C1(VSS_C1) U2.C5(VSS_C5) U2.C8(VSS_C8) U2.C12(VSS_C12) U2.D2(VSS_D2) U2.D4(VSS_D4) U2.D9(VSS_D9) U2.D11(VSS_D11) U2.E1(VSS_E1) U2.E5(VSS_E5) U2.E8(VSS_E8) U2.E12(VSS_E12) U2.G1(VSS_G1) U2.G3(VSS_G3) U2.G5(VSS_G5) U2.G8(VSS_G8) U2.G10(VSS_G10) U2.G12(VSS_G12) U2.J1(VSS_J1) U2.J3(VSS_J3) U2.J10(VSS_J10) U2.J12(VSS_J12) U2.K2(VSS_K2) U2.K4(VSS_K4) U2.K9(VSS_K9) U2.K11(VSS_K11) U2.N2(VSS_N2) U2.N4(VSS_N4) U2.N9(VSS_N9) U2.N11(VSS_N11) U2.P1(VSS_P1) U2.P3(VSS_P3) U2.P10(VSS_P10) U2.P12(VSS_P12) U2.T1(VSS_T1) U2.T3(VSS_T3) U2.T5(VSS_T5) U2.T8(VSS_T8) U2.T10(VSS_T10) U2.T12(VSS_T12) U2.V1(VSS_V1) U2.V5(VSS_V5) U2.V8(VSS_V8) U2.V12(VSS_V12) U2.W2(VSS_W2) U2.W4(VSS_W4) U2.W9(VSS_W9) U2.W11(VSS_W11) U2.Y1(VSS_Y1) U2.Y5(VSS_Y5) U2.Y8(VSS_Y8) U2.Y12(VSS_Y12)
ODT_CA_A: C87.1 C88.1 C89.1 C90.1 C91.1 C92.1 C93.1 C94.1 C95.1 C96.1 C97.1 C98.1 C99.1 C100.1 C101.1 C104.1 R7.1 R8.1 U2.A4(VDD2_A4) U2.A9(VDD2_A9) U2.AA3(VDDQ_AA3) U2.AA5(VDDQ_AA5) U2.AA8(VDDQ_AA8) U2.AA10(VDDQ_AA10) U2.AB4(VDD2_AB4) U2.AB9(VDD2_AB9) U2.B3(VDDQ_B3) U2.B5(VDDQ_B5) U2.B8(VDDQ_B8) U2.B10(VDDQ_B10) U2.D1(VDDQ_D1) U2.D5(VDDQ_D5) U2.D8(VDDQ_D8) U2.D12(VDDQ_D12) U2.F3(VDDQ_F3) U2.F5(VDD2_F5) U2.F8(VDD2_F8) U2.F10(VDDQ_F10) U2.G2(ODT_CA_A) U2.H1(VDD2_H1) U2.H5(VDD2_H5) U2.H8(VDD2_H8) U2.H12(VDD2_H12) U2.K1(VDD2_K1) U2.K3(VDD2_K3) U2.K10(VDD2_K10) U2.K12(VDD2_K12) U2.N1(VDD2_N1) U2.N3(VDD2_N3) U2.N10(VDD2_N10) U2.N12(VDD2_N12) U2.R1(VDD2_R1) U2.R5(VDD2_R5) U2.R8(VDD2_R8) U2.R12(VDD2_R12) U2.T2(ODT_CA_B) U2.U3(VDDQ_U3) U2.U5(VDD2_U5) U2.U8(VDD2_U8) U2.U10(VDDQ_U10) U2.W1(VDDQ_W1) U2.W5(VDDQ_W5) U2.W8(VDDQ_W8) U2.W12(VDDQ_W12)  [also labelled NVCC_DRAM_1V1, ODT_CA_B]
VDD_1V8: C80.1 C81.1 C83.1 C84.1 C85.1 C86.1 U2.F1(VDD1_F1) U2.F12(VDD1_F12) U2.G4(VDD1_G4) U2.G9(VDD1_G9) U2.T4(VDD1_T4) U2.T9(VDD1_T9) U2.U1(VDD1_U1) U2.U12(VDD1_U12)
DRAM_CA0_A: U1.L6(DRAM_AC08/CA0_A_/_A12) U2.R2(CA0_B)
DRAM_CA0_B: U1.W4(DRAM_AC28/CA0_B_/_A13) U2.H2(CA0_A)
DRAM_CA1_A: U1.L4(DRAM_AC09/CA1_A_/_A11) U2.P2(CA1_B)
DRAM_CA1_B: U1.W5(DRAM_AC29/CA1_B_/_BA0) U2.J2(CA1_A)
DRAM_CA2_A: U1.E4(DRAM_AC10/CA2_A_/_A7) U2.R9(CA2_B)
DRAM_CA2_B: U1.AE4(DRAM_AC30/CA2_B_/_A10(AP)) U2.H9(CA2_A)
DRAM_CA3_A: U1.D4(DRAM_AC11/CA3_A_/_A8) U2.R10(CA3_B)
DRAM_CA3_B: U1.AF4(DRAM_AC31/CA3_B_/_A0) U2.H10(CA3_A)
DRAM_CA4_A: U1.N4(DRAM_AC12/CA4_A_/_A6) U2.R11(CA4_B)
DRAM_CA4_B: U1.U5(DRAM_AC32/CA4_B_/_C2) U2.H11(CA4_A)
DRAM_CA5_A: U1.N5(DRAM_AC13/CA5_A_/_A5) U2.P11(CA5_B)
DRAM_CA5_B: U1.U6(DRAM_AC33/CA5_B/_CAS_n(A15)) U2.J11(CA5_A)
DRAM_CK_C_A: R9.2 U1.M2(DRAM_AC05/CK_c_A_/_BG1) U2.P9(CK_c_B)
DRAM_CK_C_B: R10.2 U1.V1(DRAM_AC25/CK_c_B_/_A1) U2.J9(CK_c_A)
DRAM_CK_T_A: R9.1 U1.M1(DRAM_AC04/CK_t_A_/_BG0) U2.P8(CK_t_B)
DRAM_CK_T_B: R10.1 U1.V2(DRAM_AC24/CK_t_B_/_A2) U2.J8(CK_t_A)
DRAM_CKE0_A: R3.2 U1.J6(DRAM_AC00/CKE0_A_/_CKE0) U2.P4(CKE0_B)
DRAM_CKE0_B: R1.2 U1.AA4(DRAM_AC20/CKE0_B_/_CK_t_B) U2.J4(CKE0_A)
DRAM_CKE1_A: R4.2 U1.G5(DRAM_AC01/CKE1_A_/_CKE1) U2.P5(CKE1_B)
DRAM_CKE1_B: R2.2 U1.AA5(DRAM_AC21/CKE1_B_/_CK_c_B) U2.J5(CKE1_A)
DRAM_DATA0_A: U1.B3(DRAM_DQ00) U2.AA11(DQ8_B)
DRAM_DATA0_B: U1.AC1(DRAM_DQ16) U2.B2(DQ0_A)
DRAM_DATA1_A: U1.A2(DRAM_DQ01) U2.Y11(DQ9_B)
DRAM_DATA1_B: U1.AB1(DRAM_DQ17) U2.C2(DQ1_A)
DRAM_DATA2_A: U1.E1(DRAM_DQ02) U2.V11(DQ10_B)
DRAM_DATA2_B: U1.W2(DRAM_DQ18) U2.F2(DQ3_A)
DRAM_DATA3_A: U1.F2(DRAM_DQ03) U2.U11(DQ11_B)
DRAM_DATA3_B: U1.Y2(DRAM_DQ19) U2.E2(DQ2_A)
DRAM_DATA4_A: U1.E2(DRAM_DQ04) U2.U9(DQ12_B)
DRAM_DATA4_B: U1.Y1(DRAM_DQ20) U2.E4(DQ5_A)
DRAM_DATA5_A: U1.C1(DRAM_DQ05) U2.V9(DQ13_B)
DRAM_DATA5_B: U1.W1(DRAM_DQ21) U2.F4(DQ4_A)
DRAM_DATA6_A: U1.C2(DRAM_DQ06) U2.Y9(DQ14_B)
DRAM_DATA6_B: U1.AC2(DRAM_DQ22) U2.B4(DQ7_A)
DRAM_DATA7_A: U1.B1(DRAM_DQ07) U2.AA9(DQ15_B)
DRAM_DATA7_B: TP23.1(Pin1) U1.AD1(DRAM_DQ23) U2.C4(DQ6_A)
DRAM_DATA8_A: U1.G1(DRAM_DQ08) U2.AA2(DQ0_B)
DRAM_DATA8_B: U1.AH3(DRAM_DQ24) U2.B11(DQ8_A)
DRAM_DATA9_A: U1.H1(DRAM_DQ09) U2.Y2(DQ1_B)
DRAM_DATA9_B: U1.AJ2(DRAM_DQ25) U2.C11(DQ9_A)
DRAM_DATA10_A: U1.K1(DRAM_DQ10) U2.V4(DQ5_B)
DRAM_DATA10_B: U1.AE1(DRAM_DQ26) U2.E11(DQ10_A)
DRAM_DATA11_A: U1.K2(DRAM_DQ11) U2.V2(DQ2_B)
DRAM_DATA11_B: U1.AD2(DRAM_DQ27) U2.F11(DQ11_A)
DRAM_DATA12_A: U1.L2(DRAM_DQ12) U2.U2(DQ3_B)
DRAM_DATA12_B: U1.AE2(DRAM_DQ28) U2.F9(DQ12_A)
DRAM_DATA13_A: U1.L1(DRAM_DQ13) U2.U4(DQ4_B)
DRAM_DATA13_B: U1.AG1(DRAM_DQ29) U2.E9(DQ13_A)
DRAM_DATA14_A: U1.G2(DRAM_DQ14) U2.AA4(DQ7_B)
DRAM_DATA14_B: U1.AG2(DRAM_DQ30) U2.C9(DQ14_A)
DRAM_DATA15_A: TP24.1(Pin1) U1.F1(DRAM_DQ15) U2.Y4(DQ6_B)
DRAM_DATA15_B: U1.AH1(DRAM_DQ31) U2.B9(DQ15_A)
DRAM_DMI0_A: U1.B2(DRAM_DM0) U2.Y10(DMI1_B)
DRAM_DMI0_B: U1.AB2(DRAM_DM2) U2.C3(DMI0_A)
DRAM_DMI1_A: U1.H2(DRAM_DM1) U2.Y3(DMI0_B)
DRAM_DMI1_B: U1.AH2(DRAM_DM3) U2.C10(DMI1_A)
DRAM_nCS0_A: U1.N6(DRAM_AC02/CS0_A_/_CS0_n) U2.R4(CS0_B)
DRAM_nCS0_B: U1.U4(DRAM_AC23/CS0_B_/_--) U2.H4(CS0_A)
DRAM_nCS1_A: U1.J4(DRAM_AC03/CS1_A_/_C0) U2.R3(CS1_B)
DRAM_nCS1_B: U1.AA6(DRAM_AC22/CS1_B_/_--) U2.H3(CS1_A)
DRAM_nRESET: R5.2 U1.T1(DRAM_RESET_N) U2.T11(RESET_N)
DRAM_SDQS0_C_A: U1.D1(DRAM_DQS0_N) U2.V10(DQS1_c_B)
DRAM_SDQS0_C_B: U1.AA1(DRAM_DQS2_N) U2.E3(DQS0_c_A)
DRAM_SDQS0_T_A: U1.D2(DRAM_DQS0_P) U2.W10(DQS1_t_B)
DRAM_SDQS0_T_B: U1.AA2(DRAM_DQS2_P) U2.D3(DQS0_t_A)
DRAM_SDQS1_C_A: U1.J1(DRAM_DQS1_N) U2.V3(DQS0_c_B)
DRAM_SDQS1_C_B: U1.AF1(DRAM_DQS3_N) U2.E10(DQS1_c_A)
DRAM_SDQS1_T_A: U1.J2(DRAM_DQS1_P) U2.W3(DQS0_t_B)
DRAM_SDQS1_T_B: U1.AF2(DRAM_DQS3_P) U2.D10(DQS1_t_A)
DRAM_VREF: TP1.1(Pin1) U1.R2(DRAM_VREF)
DRAM_ZQ0: R7.2 U2.A5(ZQ0)
DRAM_ZQ1: R8.2 U2.A8(ZQ1)
NetR6_2: R6.2 U1.R1(DRAM_ZN)
NetTP2_1: TP2.1(Pin1) U1.P2(DRAM_AC19/MTEST_/_MTEST)

Not connected (* = marked no-connect by the designer): U1 AC4(DRAM_AC37/--_/_ODT1)* AC5(DRAM_AC38/--_/_CS1_n)* G4(DRAM_AC06/--_/_ACT_n)* J5(DRAM_AC07/--_/_A9)* L5(DRAM_AC14/_--_/_A4)* N1(DRAM_AC16/--_/_CK_t_A)* N2(DRAM_AC17/--_/_CK_c_A)* P1(DRAM_AC26/--_/_BA1)* R4(DRAM_AC27/--_/_PARITY)* R5(DRAM_AC15/--_/_A3)* T2(DRAM_ALERT_N)* U1(DRAM_AC34/_--_/_WE_n(A14))* U2(DRAM_AC35/--_/_RAS_n(A16))* W6(DRAM_AC36/--_/_ODT0)*; U2 A1(DNU_A1)* A2(DNU_A2)* A11(DNU_A11)* A12(DNU_A12)* AA1(DNU_AA1)* AA12(DNU_AA12)* AB1(DNU_AB1)* AB2(DNU_AB2)* AB11(DNU_AB11)* AB12(DNU_AB12)* B1(DNU_B1)* B12(DNU_B12)* G11(NC_G11)* K5(NC_K5)* K8(NC_K8)* N5(NC_N5)* N8(NC_N8)*

### Notes on the sheet
- LPDDR4 6GB
- (near U2) Power supply voltage sequence:
  RESET_n is held LOW.
  VDD1 >= VDD2
  VDD2 >= VDDQ
- Note:
- LPDDR4 ODT on i.MX 8M Plus is command-based, ODT_CA_A/B of LPDDR4 part should be connected directly to VDD2.
- Pin Name
- DRAM_DQS0_P
  DRAM_DQS0_N
  DRAM_DM0
  DRAM_DQ00
  DRAM_DQ01
  DRAM_DQ02
  DRAM_DQ03
  DRAM_DQ04
  DRAM_DQ05
  DRAM_DQ06
  DRAM_DQ07
  DRAM_DQS1_P
  DRAM_DQS1_N
  DRAM_DM1
  DRAM_DQ08
  DRAM_DQ09
  DRAM_DQ10
  DRAM_DQ11
  DRAM_DQ12
  DRAM_DQ13
  DRAM_DQ14
  DRAM_DQ15
  DRAM_DQS2_P
  DRAM_DQS2_N
  DRAM_DM2
  DRAM_DQ16
  DRAM_DQ17
  DRAM_DQ18
  DRAM_DQ19
  DRAM_DQ20
  DRAM_DQ21
  DRAM_DQ22
  DRAM_DQ23
  DRAM_DQS3_P
  DRAM_DQS3_N
  DRAM_DM3
  DRAM_DQ24
  DRAM_DQ25
  DRAM_DQ26
  DRAM_DQ27
  DRAM_DQ28
  DRAM_DQ29
  DRAM_DQ30
  DRAM_DQ31
- Data Bus
- DQS0_t_A
  DQS0_c_A
  DMI0_A
  DQ0_A
  DQ1_A
  DQ2_A
  DQ3_A
  DQ4_A
  DQ5_A
  DQ6_A
  DQ7_A
  DQS1_t_A
  DQS1_c_A
  DMI1_A
  DQ08_A
  DQ09_A
  DQ10_A
  DQ11_A
  DQ12_A
  DQ13_A
  DQ14_A
  DQ15_A
  DQS0_t_B
  DQS0_c_B
  DMI0_B
  DQ0_B
  DQ1_B
  DQ2_B
  DQ3_B
  DQ4_B
  DQ5_B
  DQ6_B
  DQ7_B
  DQS1_t_B
  DQS1_c_B
  DMI1_B
  DQ08_B
  DQ09_B
  DQ10_B
  DQ11_B
  DQ12_B
  DQ13_B
  DQ14_B
  DQ15_B
- LPDDR4
- DQSL_t_A
  DQSL_c_A
  DML_n_A / DBIL_n_A
  DQL0_A
  DQL1_A
  DQL2_A
  DQL3_A
  DQL4_A
  DQL5_A
  DQL6_A
  DQL7_A
  DQSU_t_A
  DQSU_c_A
  DMU_n_A / DBIU_n_A
  DQU0_A
  DQU1_A
  DQU2_A
  DQU3_A
  DQU4_A
  DQU5_A
  DQU6_A
  DQU7_A
  DQSL_t_B
  DQSL_c_B
  DML_n_B / DBIL_n_B
  DQL0_B
  DQL1_B
  DQL2_B
  DQL3_B
  DQL4_B
  DQL5_B
  DQL6_B
  DQL7_B
  DQSU_t_B
  DQSU_c_B
  DMU_n_B / DBIU_n_B
  DQU0_B
  DQU1_B
  DQU2_B
  DQU3_B
  DQU4_B
  DQU5_B
  DQU6_B
  DQU7_B
- DDR4
- DRAM_RESET_N
  DRAM_ALERT_N
  DRAM_AC00
  DRAM_AC01
  DRAM_AC02
  DRAM_AC03
  DRAM_AC04
  DRAM_AC05
  DRAM_AC06
  DRAM_AC07
  DRAM_AC08
  DRAM_AC09
  DRAM_AC10
  DRAM_AC11
  DRAM_AC12
  DRAM_AC13
  DRAM_AC14
  DRAM_AC15
  DRAM_AC16
  DRAM_AC17
  DRAM_AC19
  DRAM_AC20
  DRAM_AC21
  DRAM_AC22
  DRAM_AC23
  DRAM_AC24
  DRAM_AC25
  DRAM_AC26
  DRAM_AC27
  DRAM_AC28
  DRAM_AC29
  DRAM_AC30
  DRAM_AC31
  DRAM_AC32
  DRAM_AC33
  DRAM_AC34
  DRAM_AC35
  DRAM_AC36
  DRAM_AC37
  DRAM_AC38
  DRAM_ZN
  DRAM_VREF
- Command/Address
- RESET_N
  MTEST1
  CKE0_A
  CKE1_A
  CS0_A
  CS1_A
  CK_t_A
  CK_c_A
  /
  /
  CA0_A
  CA1_A
  CA2_A
  CA3_A
  CA4_A
  CA5_A
  /
  /
  /
  /
  MTEST
  CKE0_B
  CKE1_B
  CS1_B
  CS0_B
  CK_t_B
  CK_c_B
  /
  /
  CA0_B
  CA1_B
  CA2_B
  CA3_B
  CA4_B
  CA5_B
  /
  /
  /
  /
  /
  ZQ
  VREF
- RESET_n
  ALERT_n / MTEST1
  CKE0
  CKE1
  CS0_n
  C0
  BG0
  BG1
  ACT_n
  A9
  A12
  A11
  A7
  A8
  A6
  A5
  A4
  A3
  CK_t_A
  CK_c_A
  MTEST
  CK_t_B
  CK_c_B
  /
  /
  A2
  A1
  BA1
  PARITY
  A13
  BA0
  A10 / AP
  A0
  C2
  CAS_n / A15
  WE_n / A14
  RAS_n / A16
  ODT0
  ODT1
  CS1_n
  ZQ
  VREF
- (in symbol MIMX8MP_BGA548, part A) i.MX8MP - DDR; (LPDDR4/DDR4)

### Library data of the parts
C80 C81 C96 = CAP_NP: as C1 on sheet Page04 CPU PWR; HEIGHT: 0.65 MM; ROHS: Yes; Tolerance: 20%; PCB Footprint: 0402_CC
C83 C85 C91 C92 C94 C97 C99 C100 C104 = CAP_NP: as C2 on sheet Page04 CPU PWR; Tolerance: 20%; ROHS: Yes; HEIGHT: 0.35MM; PCB Footprint: 0201_CC; Package Size: 0201; Package Type: 7¡± reel
C84 C86 C89 C90 C93 C95 C98 C101 = CAP_NP: as C3 on sheet Page04 CPU PWR; HEIGHT: 0.35MM; ROHS: Yes; Tolerance: 20%; PCB Footprint: 0201_CC; Package Size: 0201; Package Type: 7¡± reel
C87 C88 = CAP_NP: as C13 on sheet Page04 CPU PWR; Tolerance: 20%; ROHS: Yes; HEIGHT: 0.65 MM; PCB Footprint: 0402_CC
R1 R2 = RES: RES MF 10K 1/16W 5% 0402; CLASS: DISCRETE; AGILE_PN: 470-75557; MFG_NAME01: VISHAY INTERTECHNOLOGY; MFG_PN01: CRCW040210K0JNED; CAD_APPROVED: Yes; FPLIST: RC0402_25,RC0402_HD,0402_CC; PCB Footprint: 0402_CC; HEIGHT: 0.4 MM; Tolerance: 5%; ROHS: Yes
R3 R4 = RES: RES MF 10K 1/16W 5% 0402; CLASS: DISCRETE; FPLIST: RC0402_25,RC0402_HD,0402_CC; CAD_APPROVED: Yes; MFG_PN01: CRCW040210K0JNED; MFG_NAME01: VISHAY INTERTECHNOLOGY; AGILE_PN: 470-75557; PCB Footprint: 0402_CC; ROHS: Yes; Tolerance: 5%; HEIGHT: 0.4 MM
R5 = RES: RES MF 10K 1/20W 5% 0201; CLASS: DISCRETE; FPLIST: RC0201,0201_CC; CAD_APPROVED: Yes; MFG_PN01: RTT01103JTH; MFG_NAME01: RALEC ELECTRONIC CORP; AGILE_PN: 470-79719; HEIGHT: 0.26 MM; ROHS: Yes; Tolerance: 5%; PCB Footprint: 0201_CC
R6 = RES: RES MF 240 OHM 1/20W 1% 0201; CLASS: DISCRETE; Temp Range: -55¡ãC ~ 125¡ãC; VOLTAGE: 25V; FPLIST: CC0201,CC0201_HD,0201_CC; CAD_APPROVED: Yes; MFG_PN01: RC0201FR-07240RL; MFG_NAME01: YAGEO AMERICA; AGILE_PN: 470-81317; HEIGHT: 0.26MM; Temp_Range: -55¡ãC ~ 125¡ãC; ROHS: Yes; PCB Footprint: 0201_CC
R7 = RES: RES MF 240 OHM 1/20W 1% 0201; CLASS: DISCRETE; AGILE_PN: 470-81317; MFG_NAME01: YAGEO AMERICA; MFG_PN01: RC0201FR-07240RL; Temp_Range: -55¡ãC ~ 125¡ãC; CAD_APPROVED: Yes; FPLIST: CC0201,CC0201_HD,0201_CC; VOLTAGE: 25V; PCB Footprint: 0201_CC; ROHS: Yes; HEIGHT: 0.26MM; Temp Range: -55¡ãC ~ 125¡ãC
R8 = RES: RES MF 240 OHM 1/20W 1% 0201; CLASS: DISCRETE; FPLIST: CC0201,CC0201_HD,0201_CC; CAD_APPROVED: Yes; Temp_Range: -55¡ãC ~ 125¡ãC; MFG_PN01: RC0201FR-07240RL; MFG_NAME01: YAGEO AMERICA; AGILE_PN: 470-81317; VOLTAGE: 25V; PCB Footprint: 0201_CC; HEIGHT: 0.26MM; ROHS: Yes; Temp Range: -55¡ãC ~ 125¡ãC
R9 R10 = RES: RES MF 150 OHM 1/16W 1% 0402; CLASS: DISCRETE; FPLIST: RC0402_25,RC0402_HD,0402_CC; CAD_APPROVED: Yes; MFG_PN01: NRCL04F1500TRF; MFG_NAME01: NIC COMPONENTS CORP; AGILE_PN: 470-75353; HEIGHT: 0.4MM; ROHS: Yes; PCB Footprint: 0402_CC
TP1 TP2 = TESTLOOP: TEST POINT PAD 15MIL DIA SMT, NO PART TO ORDER; ASSY_OPT: DNP; CLASS: IO; MFG_PN01: NOTACOMPONENT; CAD_APPROVED: Yes; AGILE_PN: 211-76645; PCB Footprint: TPAD_015; MFG_NAME01: NOTACOMPONENT; ROHS: Yes; HEIGHT: 0.1MM
TP23 = TESTLOOP: TEST POINT PAD 0.5MM DIA SMT, NO PART TO ORDER; ASSY_OPT: DNP; CLASS: IO; CAD_APPROVED: Yes; AGILE_PN: 211-77484; HEIGHT: 0.1MM; ROHS: Yes; PCB Footprint: tpad_020
TP24 = TESTLOOP: as TP49 on sheet Page04 CPU PWR; ROHS: Yes; HEIGHT: 0.1MM; PCB Footprint: tpad_020
U1 = MIMX8MP_BGA548: IC CPU QUAD CORTEX A53+M4 1.8GHZ BGA548; SPLIT_INST: TRUE; CAD_APPROVED: Yes; MFG_NAME01: NXP SEMICONDUCTORS; AGILE_PN: 330-77126; PCB Footprint: bga548_0p5_15x15mm; CLASS: IC; HEIGHT: 2.1MM; MFG_PN01: MIMX8ML8DVNLZAB
U2 = MT53B768M32D4NQ_200P: IC MEM LPDDR4 LPDDR4X SDRAM 1536 Meg x 32 1.1V VFBGA200; SWAP_INFO: (S1+S2); SPLIT_INST: TRUE; AGILE_PN: TMP-WF-36000; MFG_NAME01: MICRON; Temp_Range: ¨C25¡ãC to +85¡ãC; PRE_APN: 334-77850; CAD_APPROVED: Yes; CLASS: IC; PCB Footprint: bga200_0p65x0p8_10p1x14p6; MFG_PN01: MT53E1536M32D4DT-046 WT:A; ROHS: Yes; HEIGHT: 0.95MM; VOLTAGE: 1.1V; Temp Range: ¨C25¡ãC to +85¡ãC

## Sheet Page06 CPU IO.SchDoc
size 513 x 386 mm
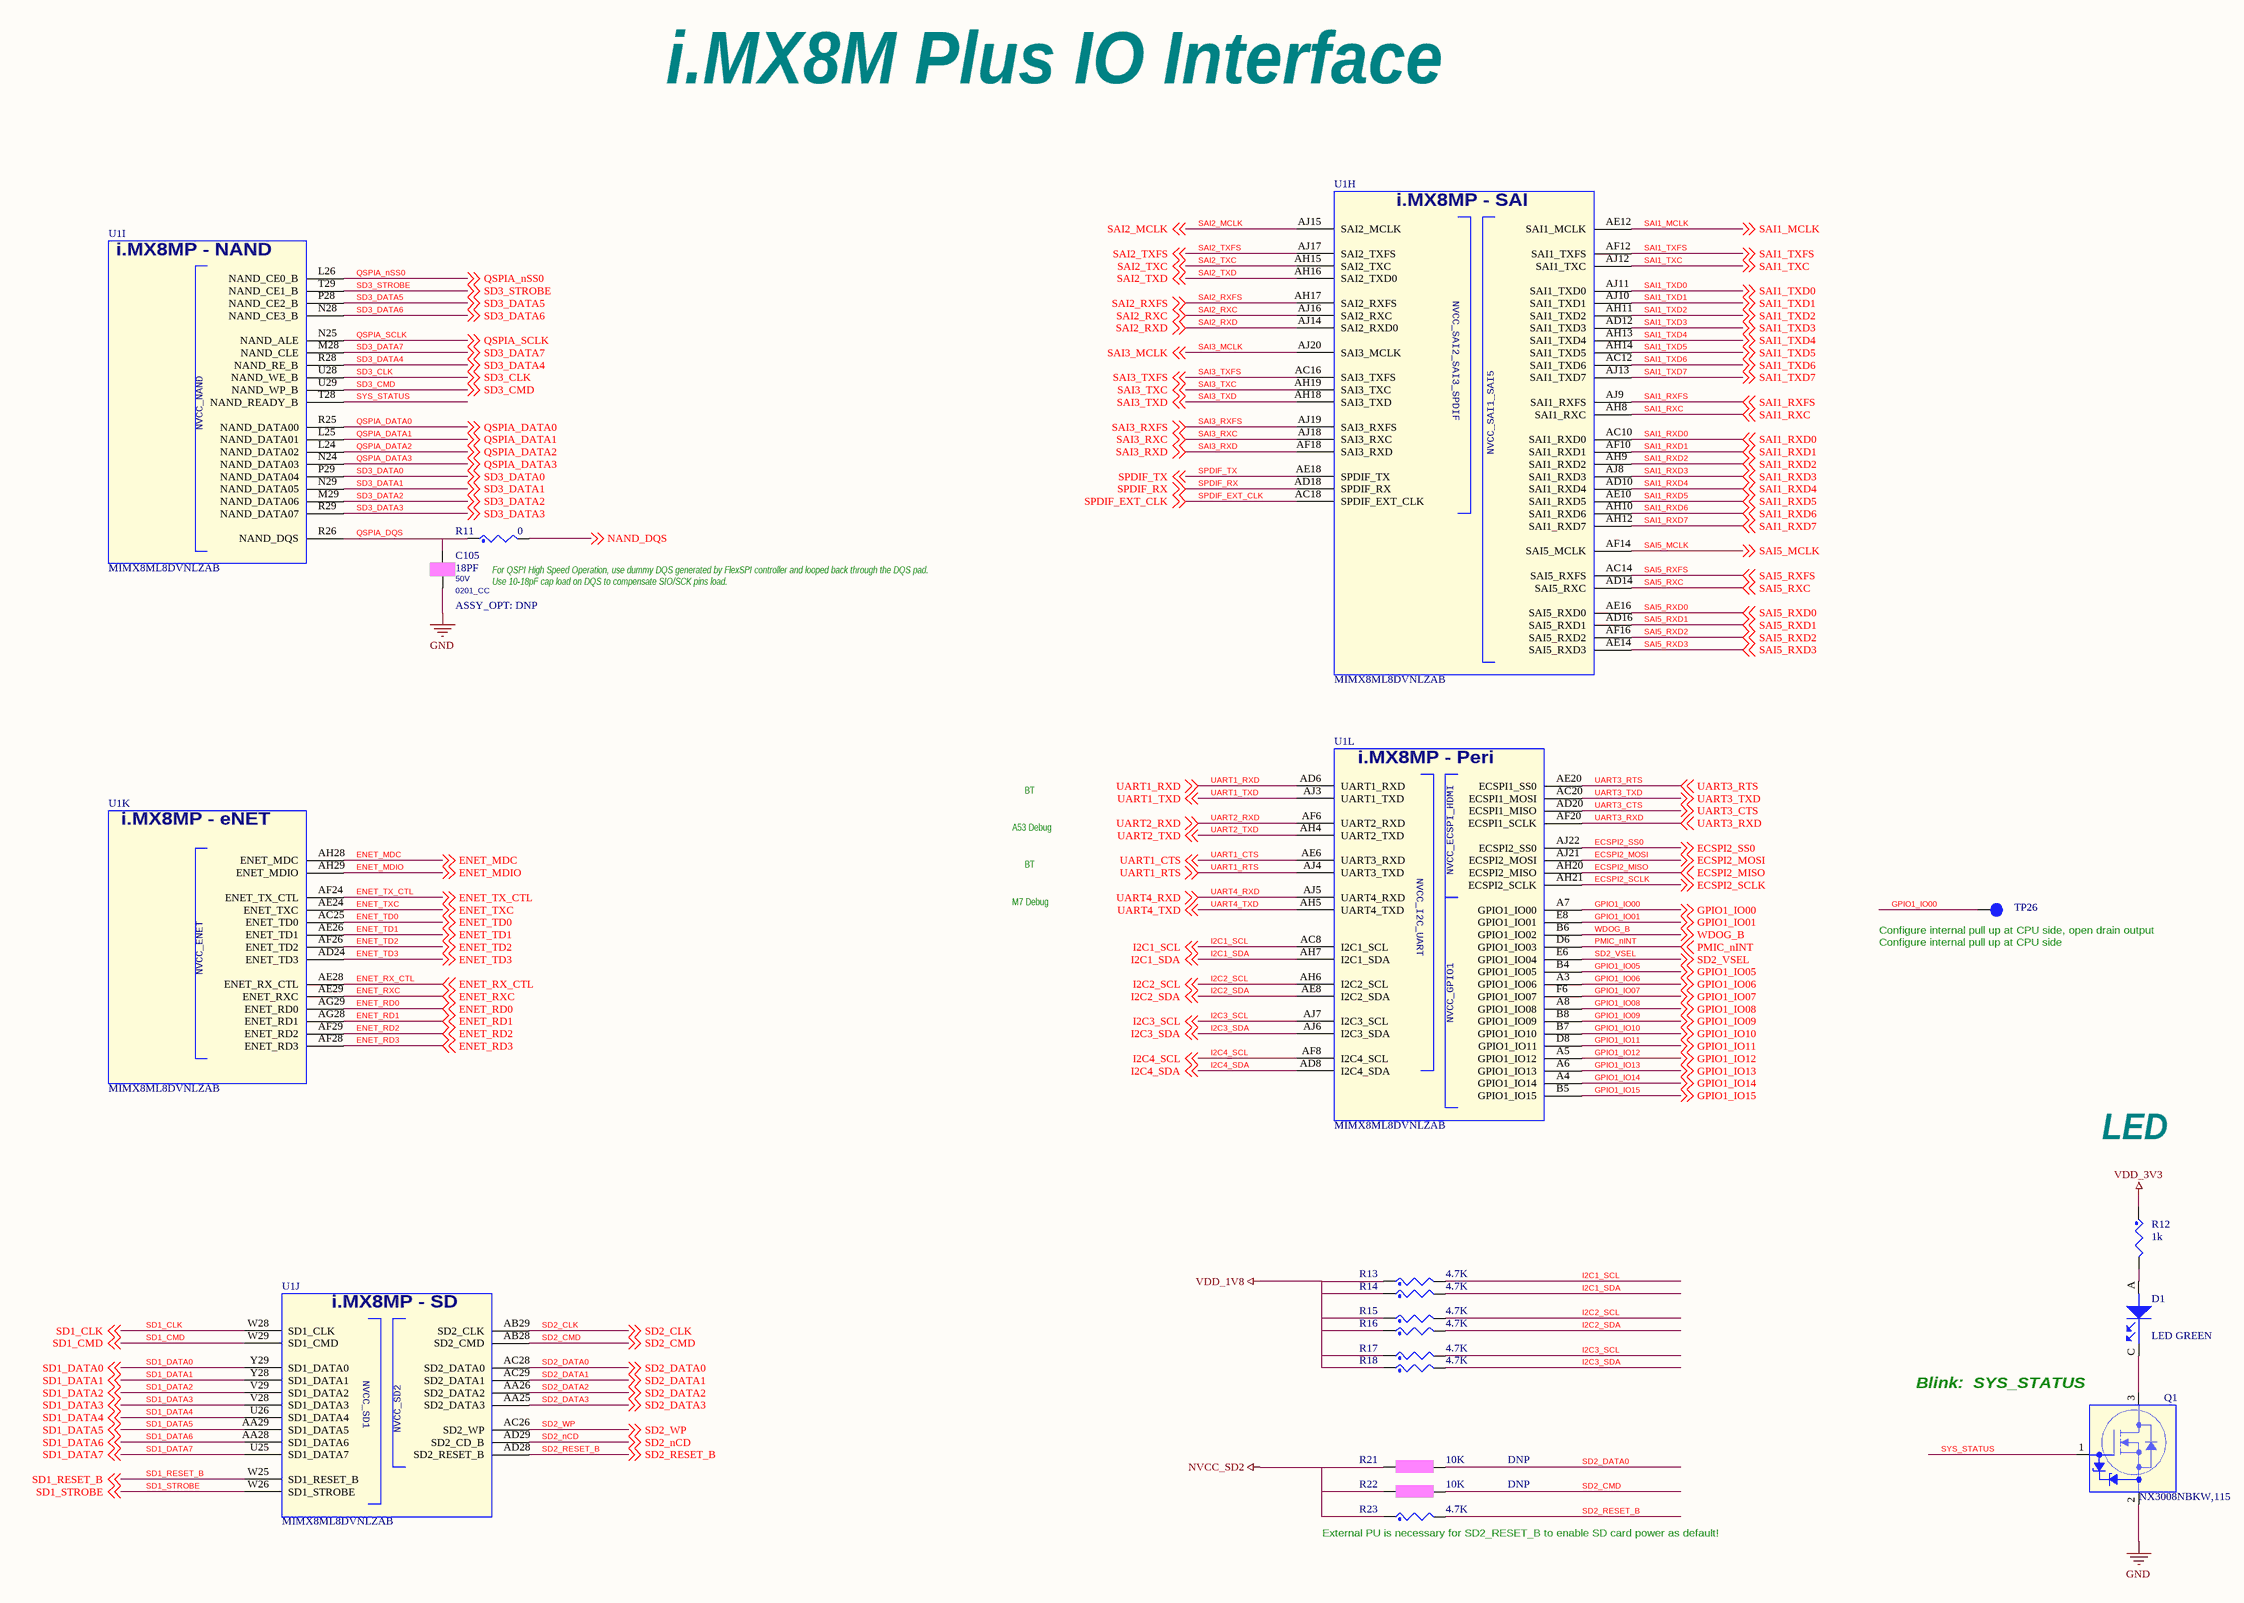
[diagram p7: Page06 CPU IO.SchDoc]

### Parts
C105  18PF  ASSY_OPT: DNP  VOLTAGE: 50V  [0201_CC]
D1  LED GREEN  [LED_0603]
Q1  NX3008NBKW,115  [sc70_3]
R11  0  [RC0402_25]
R12  1k  [0402_CC]
R13  4.7K  [0201_CC]
R14  4.7K  [0201_CC]
R15  4.7K  [0201_CC]
R16  4.7K  [0201_CC]
R17  4.7K  [0201_CC]
R18  4.7K  [0201_CC]
R21  10K  ASSY_OPT: DNP  [0201_CC]
R22  10K  ASSY_OPT: DNP  [0201_CC]
R23  4.7K  [0201_CC]
TP26  tpad_020  [tpad_020]  (value not drawn)
U1  MIMX8ML8DVNLZAB  [BGA_M865S_0P5_15X15-BMS]  (parts H,I,J,K,L of 15)

### Nets
GND: C105.2 Q1.2(SOURCE)
NVCC_SD2: R21.1 R22.1 R23.1
VDD_1V8: R13.1 R14.1 R15.1 R16.1 R17.1 R18.1
VDD_3V3: R12.1
ECSPI2_MISO: U1.AH20(ECSPI2_MISO) ; off-sheet ECSPI2_MISO
ECSPI2_MOSI: U1.AJ21(ECSPI2_MOSI) ; off-sheet ECSPI2_MOSI
ECSPI2_SCLK: U1.AH21(ECSPI2_SCLK) ; off-sheet ECSPI2_SCLK
ECSPI2_SS0: U1.AJ22(ECSPI2_SS0) ; off-sheet ECSPI2_SS0
ENET_MDC: U1.AH28(ENET_MDC) ; off-sheet ENET_MDC
ENET_MDIO: U1.AH29(ENET_MDIO) ; off-sheet ENET_MDIO
ENET_RD0: U1.AG29(ENET_RD0) ; off-sheet ENET_RD0
ENET_RD1: U1.AG28(ENET_RD1) ; off-sheet ENET_RD1
ENET_RD2: U1.AF29(ENET_RD2) ; off-sheet ENET_RD2
ENET_RD3: U1.AF28(ENET_RD3) ; off-sheet ENET_RD3
ENET_RX_CTL: U1.AE28(ENET_RX_CTL) ; off-sheet ENET_RX_CTL
ENET_RXC: U1.AE29(ENET_RXC) ; off-sheet ENET_RXC
ENET_TD0: U1.AC25(ENET_TD0) ; off-sheet ENET_TD0
ENET_TD1: U1.AE26(ENET_TD1) ; off-sheet ENET_TD1
ENET_TD2: U1.AF26(ENET_TD2) ; off-sheet ENET_TD2
ENET_TD3: U1.AD24(ENET_TD3) ; off-sheet ENET_TD3
ENET_TX_CTL: U1.AF24(ENET_TX_CTL) ; off-sheet ENET_TX_CTL
ENET_TXC: U1.AE24(ENET_TXC) ; off-sheet ENET_TXC
GPIO1_IO00: TP26.1(Pin1) U1.A7(GPIO1_IO00) ; off-sheet GPIO1_IO00
GPIO1_IO01: U1.E8(GPIO1_IO01) ; off-sheet GPIO1_IO01
GPIO1_IO05: U1.B4(GPIO1_IO05) ; off-sheet GPIO1_IO05
GPIO1_IO06: U1.A3(GPIO1_IO06) ; off-sheet GPIO1_IO06
GPIO1_IO07: U1.F6(GPIO1_IO07) ; off-sheet GPIO1_IO07
GPIO1_IO08: U1.A8(GPIO1_IO08) ; off-sheet GPIO1_IO08
GPIO1_IO09: U1.B8(GPIO1_IO09) ; off-sheet GPIO1_IO09
GPIO1_IO10: U1.B7(GPIO1_IO10) ; off-sheet GPIO1_IO10
GPIO1_IO11: U1.D8(GPIO1_IO11) ; off-sheet GPIO1_IO11
GPIO1_IO12: U1.A5(GPIO1_IO12) ; off-sheet GPIO1_IO12
GPIO1_IO13: U1.A6(GPIO1_IO13) ; off-sheet GPIO1_IO13
GPIO1_IO14: U1.A4(GPIO1_IO14) ; off-sheet GPIO1_IO14
GPIO1_IO15: U1.B5(GPIO1_IO15) ; off-sheet GPIO1_IO15
I2C1_SCL: R13.2 U1.AC8(I2C1_SCL) ; off-sheet I2C1_SCL
I2C1_SDA: R14.2 U1.AH7(I2C1_SDA) ; off-sheet I2C1_SDA
I2C2_SCL: R15.2 U1.AH6(I2C2_SCL) ; off-sheet I2C2_SCL
I2C2_SDA: R16.2 U1.AE8(I2C2_SDA) ; off-sheet I2C2_SDA
I2C3_SCL: R17.2 U1.AJ7(I2C3_SCL) ; off-sheet I2C3_SCL
I2C3_SDA: R18.2 U1.AJ6(I2C3_SDA) ; off-sheet I2C3_SDA
I2C4_SCL: U1.AF8(I2C4_SCL) ; off-sheet I2C4_SCL
I2C4_SDA: U1.AD8(I2C4_SDA) ; off-sheet I2C4_SDA
NAND_DQS: R11.2 ; off-sheet NAND_DQS
PMIC_nINT: U1.D6(GPIO1_IO03) ; off-sheet PMIC_nINT
QSPIA_DATA0: U1.R25(NAND_DATA00) ; off-sheet QSPIA_DATA0
QSPIA_DATA1: U1.L25(NAND_DATA01) ; off-sheet QSPIA_DATA1
QSPIA_DATA2: U1.L24(NAND_DATA02) ; off-sheet QSPIA_DATA2
QSPIA_DATA3: U1.N24(NAND_DATA03) ; off-sheet QSPIA_DATA3
QSPIA_DQS: C105.1 R11.1 U1.R26(NAND_DQS)
QSPIA_nSS0: U1.L26(NAND_CE0_B) ; off-sheet QSPIA_nSS0
QSPIA_SCLK: U1.N25(NAND_ALE) ; off-sheet QSPIA_SCLK
SAI1_MCLK: U1.AE12(SAI1_MCLK) ; off-sheet SAI1_MCLK
SAI1_RXC: U1.AH8(SAI1_RXC) ; off-sheet SAI1_RXC
SAI1_RXD0: U1.AC10(SAI1_RXD0) ; off-sheet SAI1_RXD0
SAI1_RXD1: U1.AF10(SAI1_RXD1) ; off-sheet SAI1_RXD1
SAI1_RXD2: U1.AH9(SAI1_RXD2) ; off-sheet SAI1_RXD2
SAI1_RXD3: U1.AJ8(SAI1_RXD3) ; off-sheet SAI1_RXD3
SAI1_RXD4: U1.AD10(SAI1_RXD4) ; off-sheet SAI1_RXD4
SAI1_RXD5: U1.AE10(SAI1_RXD5) ; off-sheet SAI1_RXD5
SAI1_RXD6: U1.AH10(SAI1_RXD6) ; off-sheet SAI1_RXD6
SAI1_RXD7: U1.AH12(SAI1_RXD7) ; off-sheet SAI1_RXD7
SAI1_RXFS: U1.AJ9(SAI1_RXFS) ; off-sheet SAI1_RXFS
SAI1_TXC: U1.AJ12(SAI1_TXC) ; off-sheet SAI1_TXC
SAI1_TXD0: U1.AJ11(SAI1_TXD0) ; off-sheet SAI1_TXD0
SAI1_TXD1: U1.AJ10(SAI1_TXD1) ; off-sheet SAI1_TXD1
SAI1_TXD2: U1.AH11(SAI1_TXD2) ; off-sheet SAI1_TXD2
SAI1_TXD3: U1.AD12(SAI1_TXD3) ; off-sheet SAI1_TXD3
SAI1_TXD4: U1.AH13(SAI1_TXD4) ; off-sheet SAI1_TXD4
SAI1_TXD5: U1.AH14(SAI1_TXD5) ; off-sheet SAI1_TXD5
SAI1_TXD6: U1.AC12(SAI1_TXD6) ; off-sheet SAI1_TXD6
SAI1_TXD7: U1.AJ13(SAI1_TXD7) ; off-sheet SAI1_TXD7
SAI1_TXFS: U1.AF12(SAI1_TXFS) ; off-sheet SAI1_TXFS
SAI2_MCLK: U1.AJ15(SAI2_MCLK) ; off-sheet SAI2_MCLK
SAI2_RXC: U1.AJ16(SAI2_RXC) ; off-sheet SAI2_RXC
SAI2_RXD: U1.AJ14(SAI2_RXD0) ; off-sheet SAI2_RXD
SAI2_RXFS: U1.AH17(SAI2_RXFS) ; off-sheet SAI2_RXFS
SAI2_TXC: U1.AH15(SAI2_TXC) ; off-sheet SAI2_TXC
SAI2_TXD: U1.AH16(SAI2_TXD0) ; off-sheet SAI2_TXD
SAI2_TXFS: U1.AJ17(SAI2_TXFS) ; off-sheet SAI2_TXFS
SAI3_MCLK: U1.AJ20(SAI3_MCLK) ; off-sheet SAI3_MCLK
SAI3_RXC: U1.AJ18(SAI3_RXC) ; off-sheet SAI3_RXC
SAI3_RXD: U1.AF18(SAI3_RXD) ; off-sheet SAI3_RXD
SAI3_RXFS: U1.AJ19(SAI3_RXFS) ; off-sheet SAI3_RXFS
SAI3_TXC: U1.AH19(SAI3_TXC) ; off-sheet SAI3_TXC
SAI3_TXD: U1.AH18(SAI3_TXD) ; off-sheet SAI3_TXD
SAI3_TXFS: U1.AC16(SAI3_TXFS) ; off-sheet SAI3_TXFS
SAI5_MCLK: U1.AF14(SAI5_MCLK) ; off-sheet SAI5_MCLK
SAI5_RXC: U1.AD14(SAI5_RXC) ; off-sheet SAI5_RXC
SAI5_RXD0: U1.AE16(SAI5_RXD0) ; off-sheet SAI5_RXD0
SAI5_RXD1: U1.AD16(SAI5_RXD1) ; off-sheet SAI5_RXD1
SAI5_RXD2: U1.AF16(SAI5_RXD2) ; off-sheet SAI5_RXD2
SAI5_RXD3: U1.AE14(SAI5_RXD3) ; off-sheet SAI5_RXD3
SAI5_RXFS: U1.AC14(SAI5_RXFS) ; off-sheet SAI5_RXFS
SD1_CLK: U1.W28(SD1_CLK) ; off-sheet SD1_CLK
SD1_CMD: U1.W29(SD1_CMD) ; off-sheet SD1_CMD
SD1_DATA0: U1.Y29(SD1_DATA0) ; off-sheet SD1_DATA0
SD1_DATA1: U1.Y28(SD1_DATA1) ; off-sheet SD1_DATA1
SD1_DATA2: U1.V29(SD1_DATA2) ; off-sheet SD1_DATA2
SD1_DATA3: U1.V28(SD1_DATA3) ; off-sheet SD1_DATA3
SD1_DATA4: U1.U26(SD1_DATA4) ; off-sheet SD1_DATA4
SD1_DATA5: U1.AA29(SD1_DATA5) ; off-sheet SD1_DATA5
SD1_DATA6: U1.AA28(SD1_DATA6) ; off-sheet SD1_DATA6
SD1_DATA7: U1.U25(SD1_DATA7) ; off-sheet SD1_DATA7
SD1_RESET_B: U1.W25(SD1_RESET_B) ; off-sheet SD1_RESET_B
SD1_STROBE: U1.W26(SD1_STROBE) ; off-sheet SD1_STROBE
SD2_CLK: U1.AB29(SD2_CLK) ; off-sheet SD2_CLK
SD2_CMD: R22.2 U1.AB28(SD2_CMD) ; off-sheet SD2_CMD
SD2_DATA0: R21.2 U1.AC28(SD2_DATA0) ; off-sheet SD2_DATA0
SD2_DATA1: U1.AC29(SD2_DATA1) ; off-sheet SD2_DATA1
SD2_DATA2: U1.AA26(SD2_DATA2) ; off-sheet SD2_DATA2
SD2_DATA3: U1.AA25(SD2_DATA3) ; off-sheet SD2_DATA3
SD2_nCD: U1.AD29(SD2_CD_B) ; off-sheet SD2_nCD
SD2_RESET_B: R23.2 U1.AD28(SD2_RESET_B) ; off-sheet SD2_RESET_B
SD2_VSEL: U1.E6(GPIO1_IO04) ; off-sheet SD2_VSEL
SD2_WP: U1.AC26(SD2_WP) ; off-sheet SD2_WP
SD3_CLK: U1.U28(NAND_WE_B) ; off-sheet SD3_CLK
SD3_CMD: U1.U29(NAND_WP_B) ; off-sheet SD3_CMD
SD3_DATA0: U1.P29(NAND_DATA04) ; off-sheet SD3_DATA0
SD3_DATA1: U1.N29(NAND_DATA05) ; off-sheet SD3_DATA1
SD3_DATA2: U1.M29(NAND_DATA06) ; off-sheet SD3_DATA2
SD3_DATA3: U1.R29(NAND_DATA07) ; off-sheet SD3_DATA3
SD3_DATA4: U1.R28(NAND_RE_B) ; off-sheet SD3_DATA4
SD3_DATA5: U1.P28(NAND_CE2_B) ; off-sheet SD3_DATA5
SD3_DATA6: U1.N28(NAND_CE3_B) ; off-sheet SD3_DATA6
SD3_DATA7: U1.M28(NAND_CLE) ; off-sheet SD3_DATA7
SD3_STROBE: U1.T29(NAND_CE1_B) ; off-sheet SD3_STROBE
SPDIF_EXT_CLK: U1.AC18(SPDIF_EXT_CLK) ; off-sheet SPDIF_EXT_CLK
SPDIF_RX: U1.AD18(SPDIF_RX) ; off-sheet SPDIF_RX
SPDIF_TX: U1.AE18(SPDIF_TX) ; off-sheet SPDIF_TX
SYS_STATUS: Q1.1(GATE) U1.T28(NAND_READY_B)
UART1_CTS: U1.AE6(UART3_RXD) ; off-sheet UART1_CTS
UART1_RTS: U1.AJ4(UART3_TXD) ; off-sheet UART1_RTS
UART1_RXD: U1.AD6(UART1_RXD) ; off-sheet UART1_RXD
UART1_TXD: U1.AJ3(UART1_TXD) ; off-sheet UART1_TXD
UART2_RXD: U1.AF6(UART2_RXD) ; off-sheet UART2_RXD
UART2_TXD: U1.AH4(UART2_TXD) ; off-sheet UART2_TXD
UART3_CTS: U1.AD20(ECSPI1_MISO) ; off-sheet UART3_CTS
UART3_RTS: U1.AE20(ECSPI1_SS0) ; off-sheet UART3_RTS
UART3_RXD: U1.AF20(ECSPI1_SCLK) ; off-sheet UART3_RXD
UART3_TXD: U1.AC20(ECSPI1_MOSI) ; off-sheet UART3_TXD
UART4_RXD: U1.AJ5(UART4_RXD) ; off-sheet UART4_RXD
UART4_TXD: U1.AH5(UART4_TXD) ; off-sheet UART4_TXD
WDOG_B: U1.B6(GPIO1_IO02) ; off-sheet WDOG_B
NetD1_A: D1.A(ANODE) R12.2
NetD1_C: D1.C(CATHODE) Q1.3(DRAIN)

### Notes on the sheet
- i.MX8M Plus IO Interface
- (near R11) For QSPI High Speed Operation, use dummy DQS generated by FlexSPI controller and looped back through the DQS pad.
  Use 10-18pF cap load on DQS to compensate SIO/SCK pins load.
- A53 Debug
- BT
- M7 Debug
- (near TP26) Configure internal pull up at CPU side
- (near TP26) Configure internal pull up at CPU side, open drain output
- LED
- (near Q1) Blink:  SYS_STATUS
- (near R23) External PU is necessary for SD2_RESET_B to enable SD card power as default!
- (in symbol MIMX8MP_BGA548, part H) i.MX8MP - SAI
- (in symbol MIMX8MP_BGA548, part I) i.MX8MP - NAND
- (in symbol MIMX8MP_BGA548, part J) i.MX8MP - SD
- (in symbol MIMX8MP_BGA548, part K) i.MX8MP - eNET
- (in symbol MIMX8MP_BGA548, part L) i.MX8MP - Peri; NVCC_GPIO1

### Library data of the parts
C105 = CAP_NP: CAP CER 18pF 50V 5% C0G 0201; CLASS: DISCRETE; FPLIST: CC0201,CC0201_HD,0201_CC; CAD_APPROVED: Yes; MFG_PN01: GRM0335C1H180JA01D; MFG_NAME01: MURATA; AGILE_PN: 150-79476; Package Type: &#966;180mm Paper taping; Package Size: 0201; HEIGHT: 0.33MM; ROHS: Yes; Tolerance: 5%; PCB Footprint: 0201_CC
D1 = LED: LED GRN SGL 25MA SMT 0603; CLASS: IC; CAD_APPROVED: Yes; MFG_PN01: 598-8070-107F; MFG_NAME01: DIALIGHT; AGILE_PN: 370-76672; VOLTAGE: 2V; HEIGHT: 0.8 MM; ROHS: Yes; PCB Footprint: LED_0603
Q1 = NMOS_NX3008NBK: TRAN NMOS SW 30V 350mA AEC-Q101 SC-70; CLASS: IC; AGILE_PN: 480-79736; MFG_NAME01: NEXPERIA; CAD_APPROVED: Yes; PCB Footprint: sc70_3; MFG_PN01: NX3008NBKW,115; ROHS: Yes; HEIGHT: 1.1MM
R11 = RES: RES MF ZERO OHM 1/16W 5% 0402; CLASS: DISCRETE; SIGNAL_MODEL: DEFAULT_RESISTOR_10000OHM_2_1; CAD_APPROVED: Yes; MFG_PN01: MCR01MZPJ000; MFG_NAME01: ROHM; AGILE_PN: 470-75394; VOLTAGE: 1/16W; HEIGHT: 0.45 MM; ROHS: Yes; Tolerance: 5%; PCB Footprint: RC0402_25
R12 = RES: RES MF 1.0K 1/16W 5% 0402; CLASS: DISCRETE; AGILE_PN: 470-75555; MFG_NAME01: VISHAY INTERTECHNOLOGY; MFG_PN01: CRCW04021K00JNED; CAD_APPROVED: Yes; FPLIST: RC0402_25,RC0402_HD,RC0402_X2,0402_CC; HEIGHT: 0.41mm; TOL: 5%; Tolerance: 5%; ROHS: Yes; PCB Footprint: 0402_CC
R13 R14 R17 R18 = RES: RES MF 4.7K 1/20W 5% AEC-Q200 0201; CLASS: DISCRETE; AGILE_PN: 470-79700; MFG_NAME01: KOA SPEER; MFG_PN01: RK73B1HTTC472J; Temp_Range: -55C to +155C; CAD_APPROVED: Yes; FPLIST: RC0201,0201_CC; PCB Footprint: 0201_CC; Tolerance: 5%; ROHS: Yes; HEIGHT: 0.25MM; Temp Range: -55C to +155C
R15 R16 R23 = RES: RES MF 4.7K 1/20W 5% AEC-Q200 0201; CLASS: DISCRETE; FPLIST: RC0201,0201_CC; CAD_APPROVED: Yes; Temp_Range: -55C to +155C; MFG_PN01: RK73B1HTTC472J; MFG_NAME01: KOA SPEER; AGILE_PN: 470-79700; PCB Footprint: 0201_CC; HEIGHT: 0.25MM; ROHS: Yes; Tolerance: 5%; Temp Range: -55C to +155C
R21 = RES: RES MF 10K 1/20W 5% 0201; CLASS: DISCRETE; AGILE_PN: 470-79719; MFG_NAME01: RALEC ELECTRONIC CORP; MFG_PN01: RTT01103JTH; CAD_APPROVED: Yes; FPLIST: RC0201,0201_CC; PCB Footprint: 0201_CC; Tolerance: 5%; ROHS: Yes; HEIGHT: 0.26 MM
R22 = RES: as R5 on sheet Page05 LPDDR4; PCB Footprint: 0201_CC; HEIGHT: 0.26 MM; ROHS: Yes; Tolerance: 5%
TP26 = TESTLOOP: as TP49 on sheet Page04 CPU PWR; ROHS: Yes; HEIGHT: 0.1MM; PCB Footprint: tpad_020
U1 = MIMX8MP_BGA548: as U1 on sheet Page04 CPU PWR; CLASS: IC; HEIGHT: 2.1MM; MFG_PN01: MIMX8ML8DVNLZAB